# EAGLE schematic ams-master-pcb (EAGLE 9.6.2)
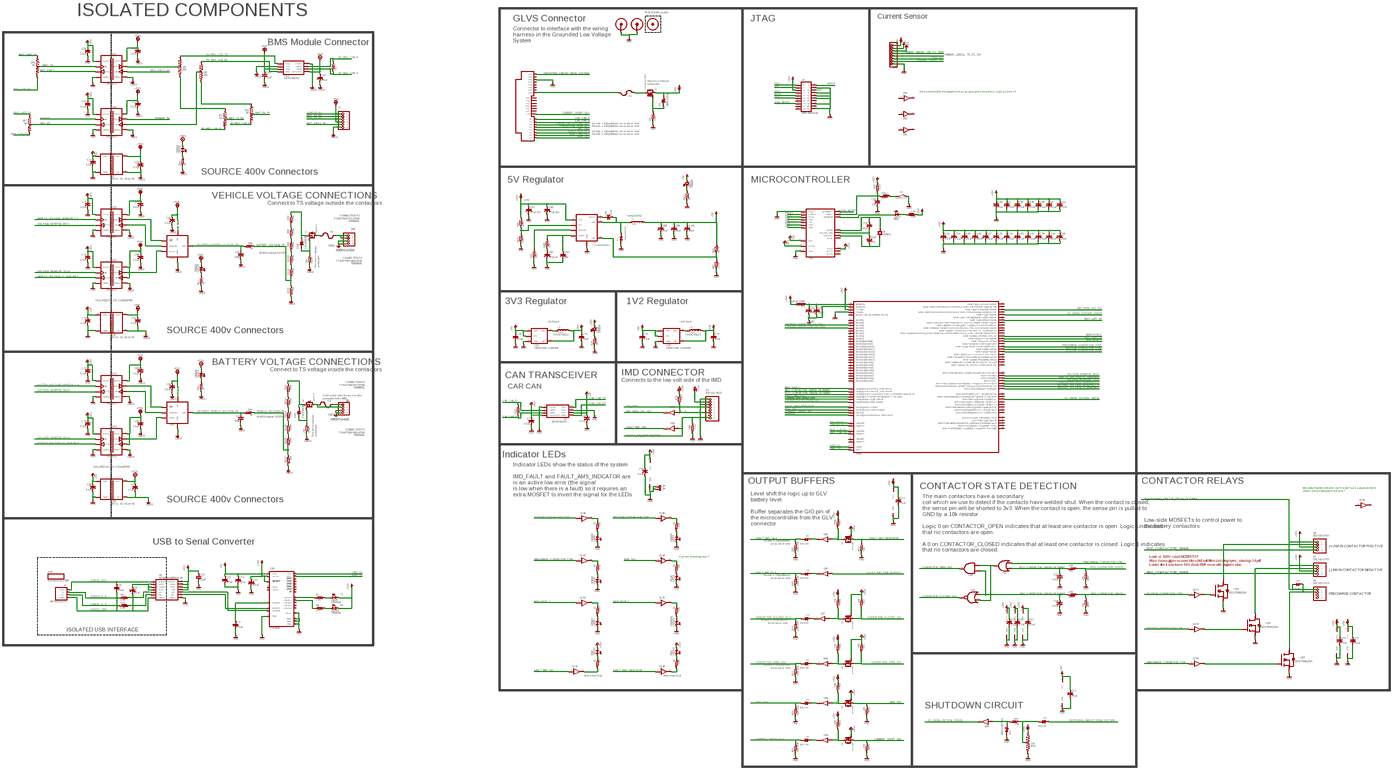
[diagram p0: schematic, sheet 1, overview]
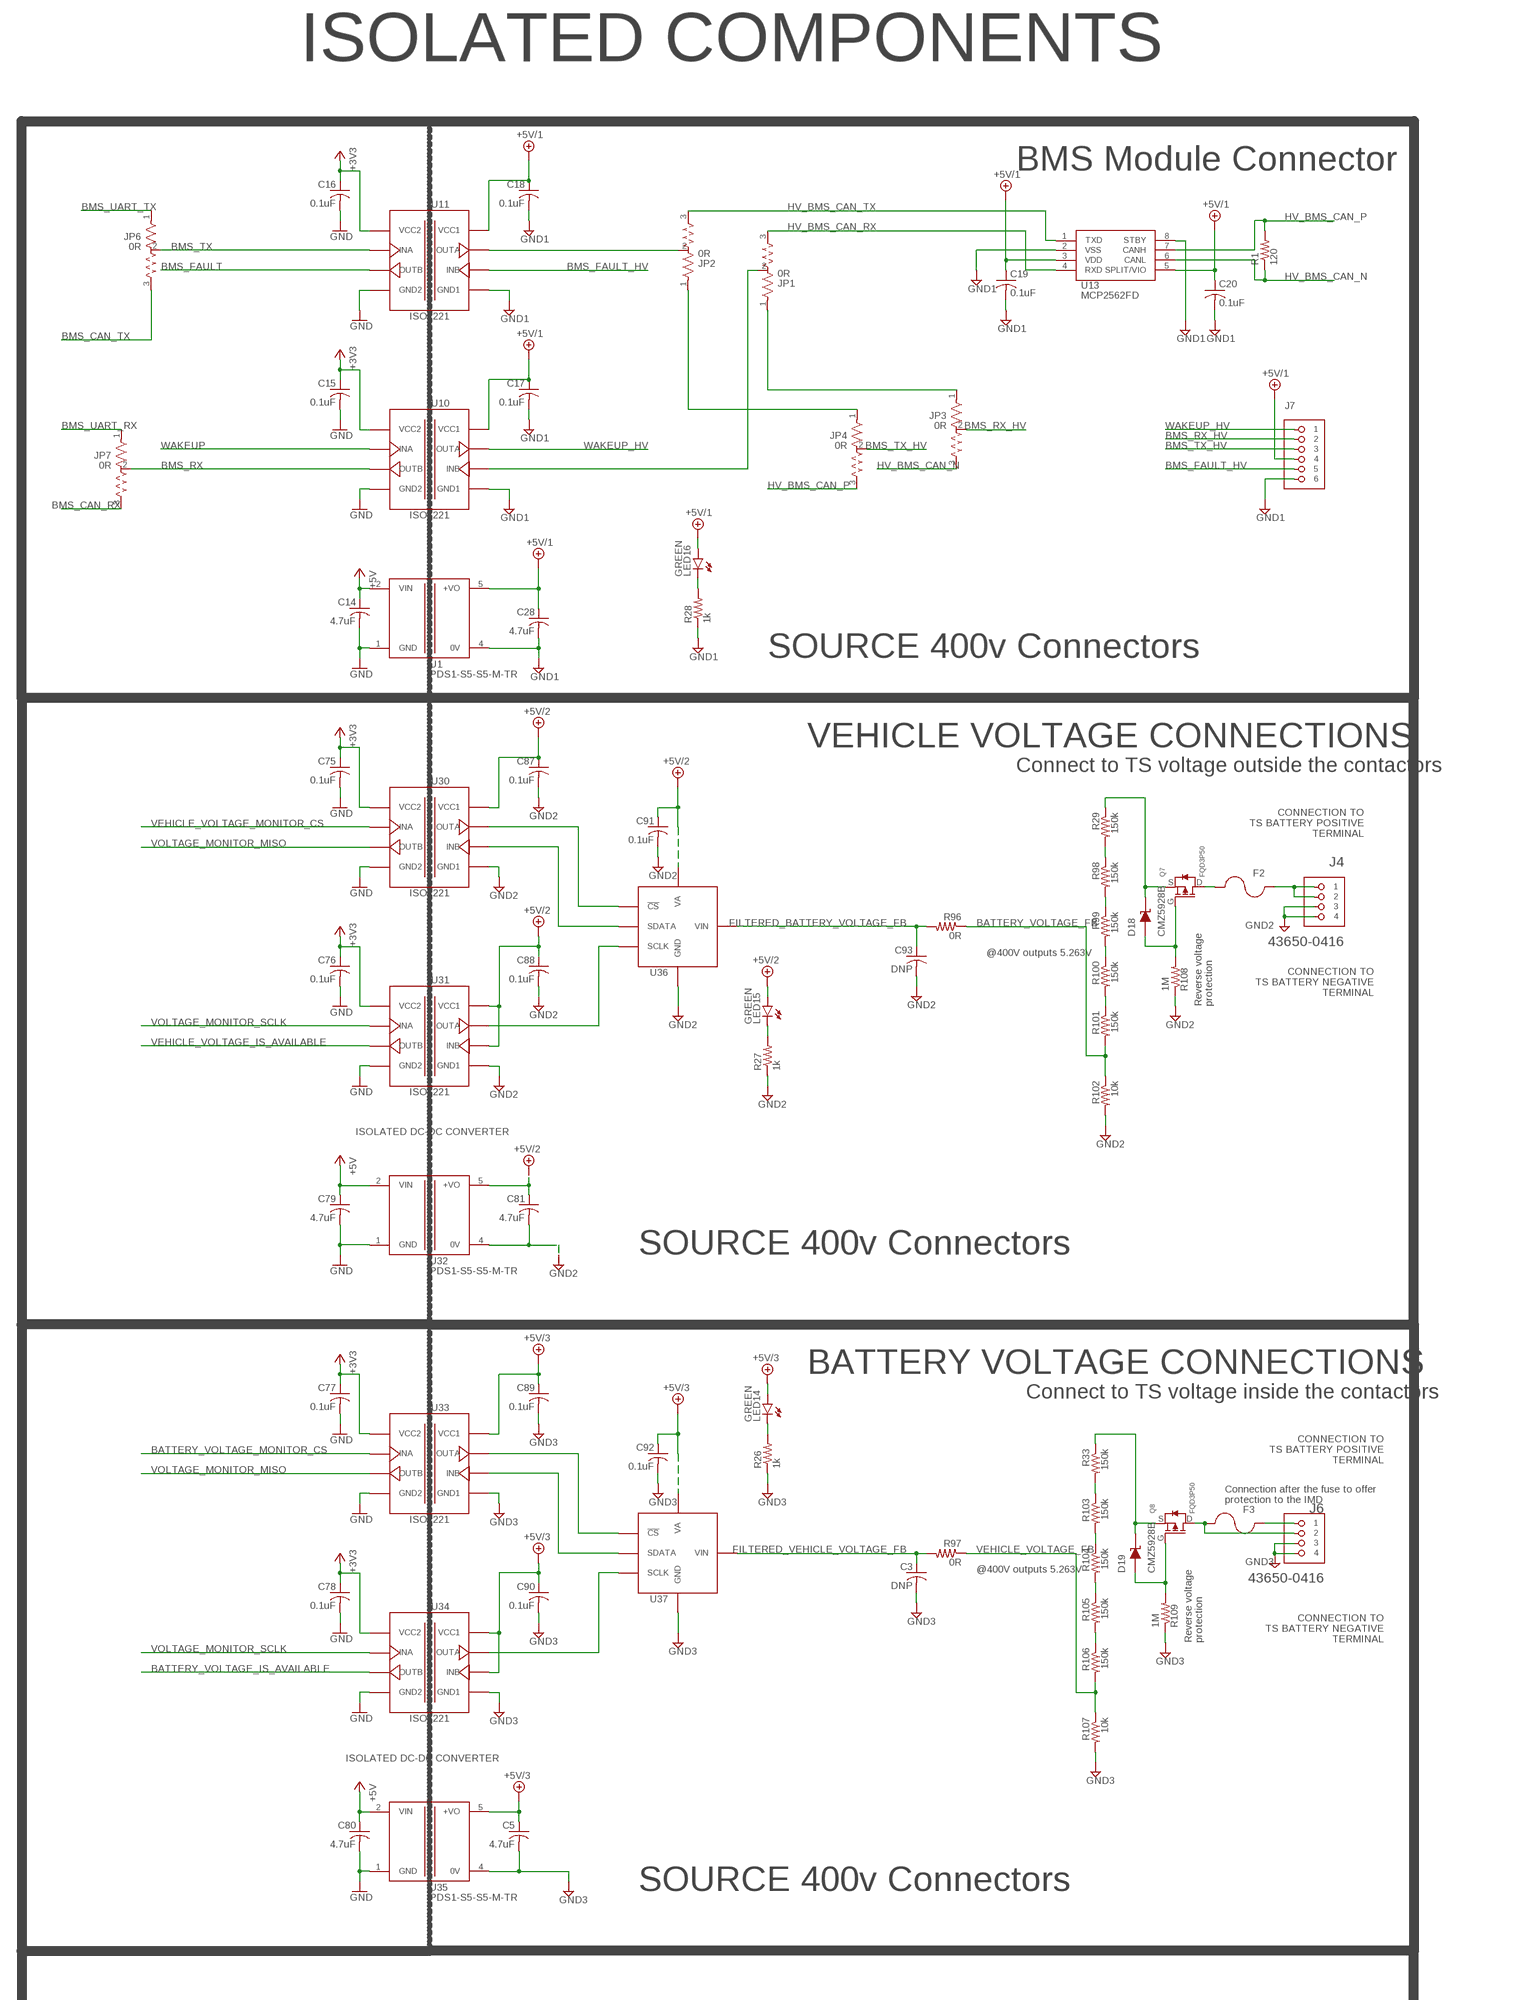
[diagram p1: schematic, sheet 1, part 1 of 6]
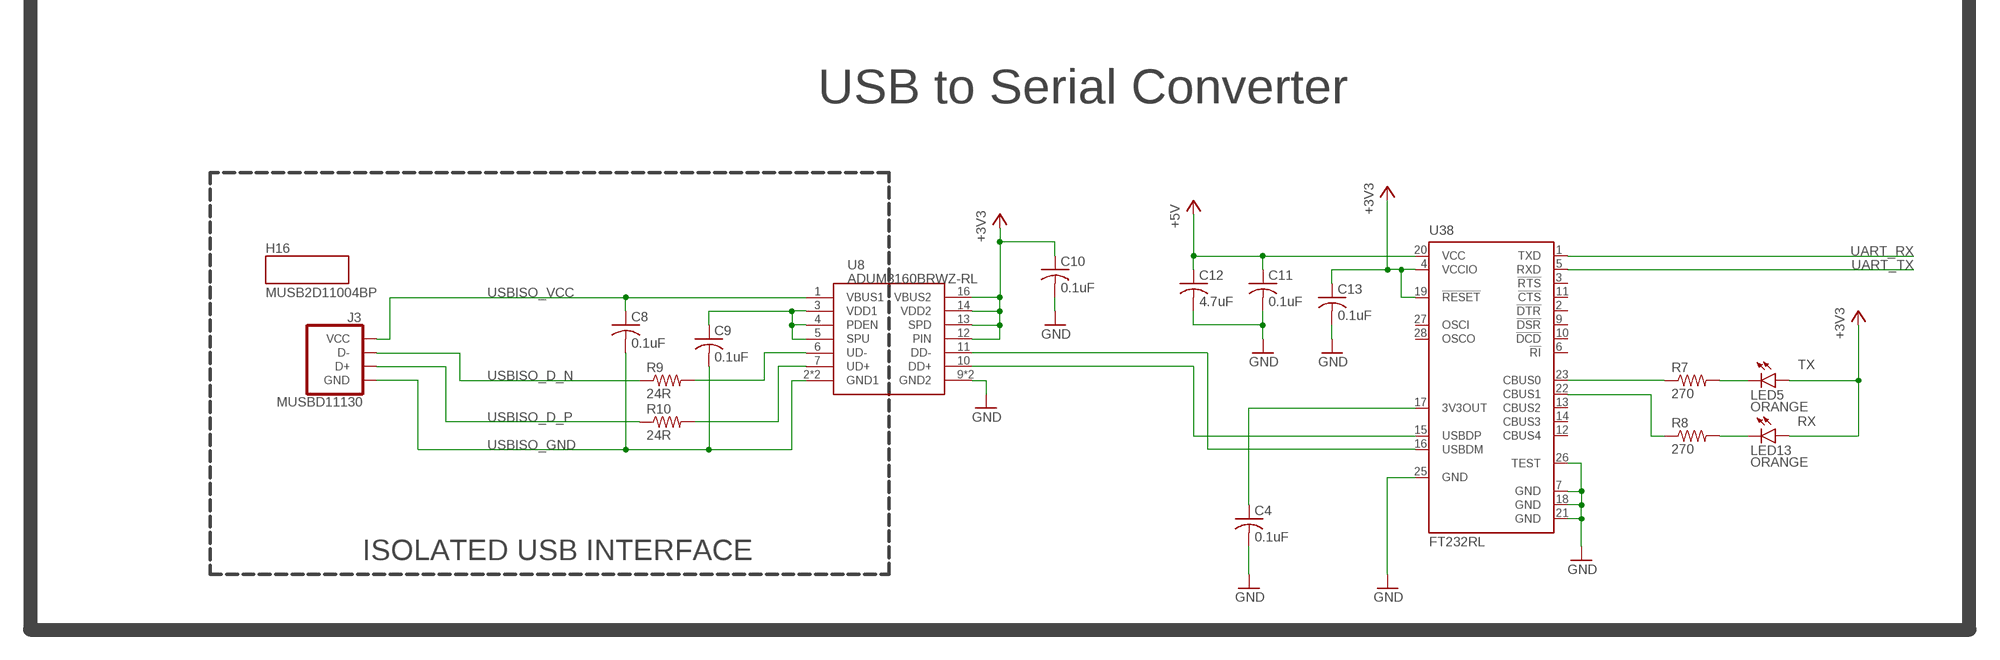
[diagram p2: schematic, sheet 1, part 2 of 6]
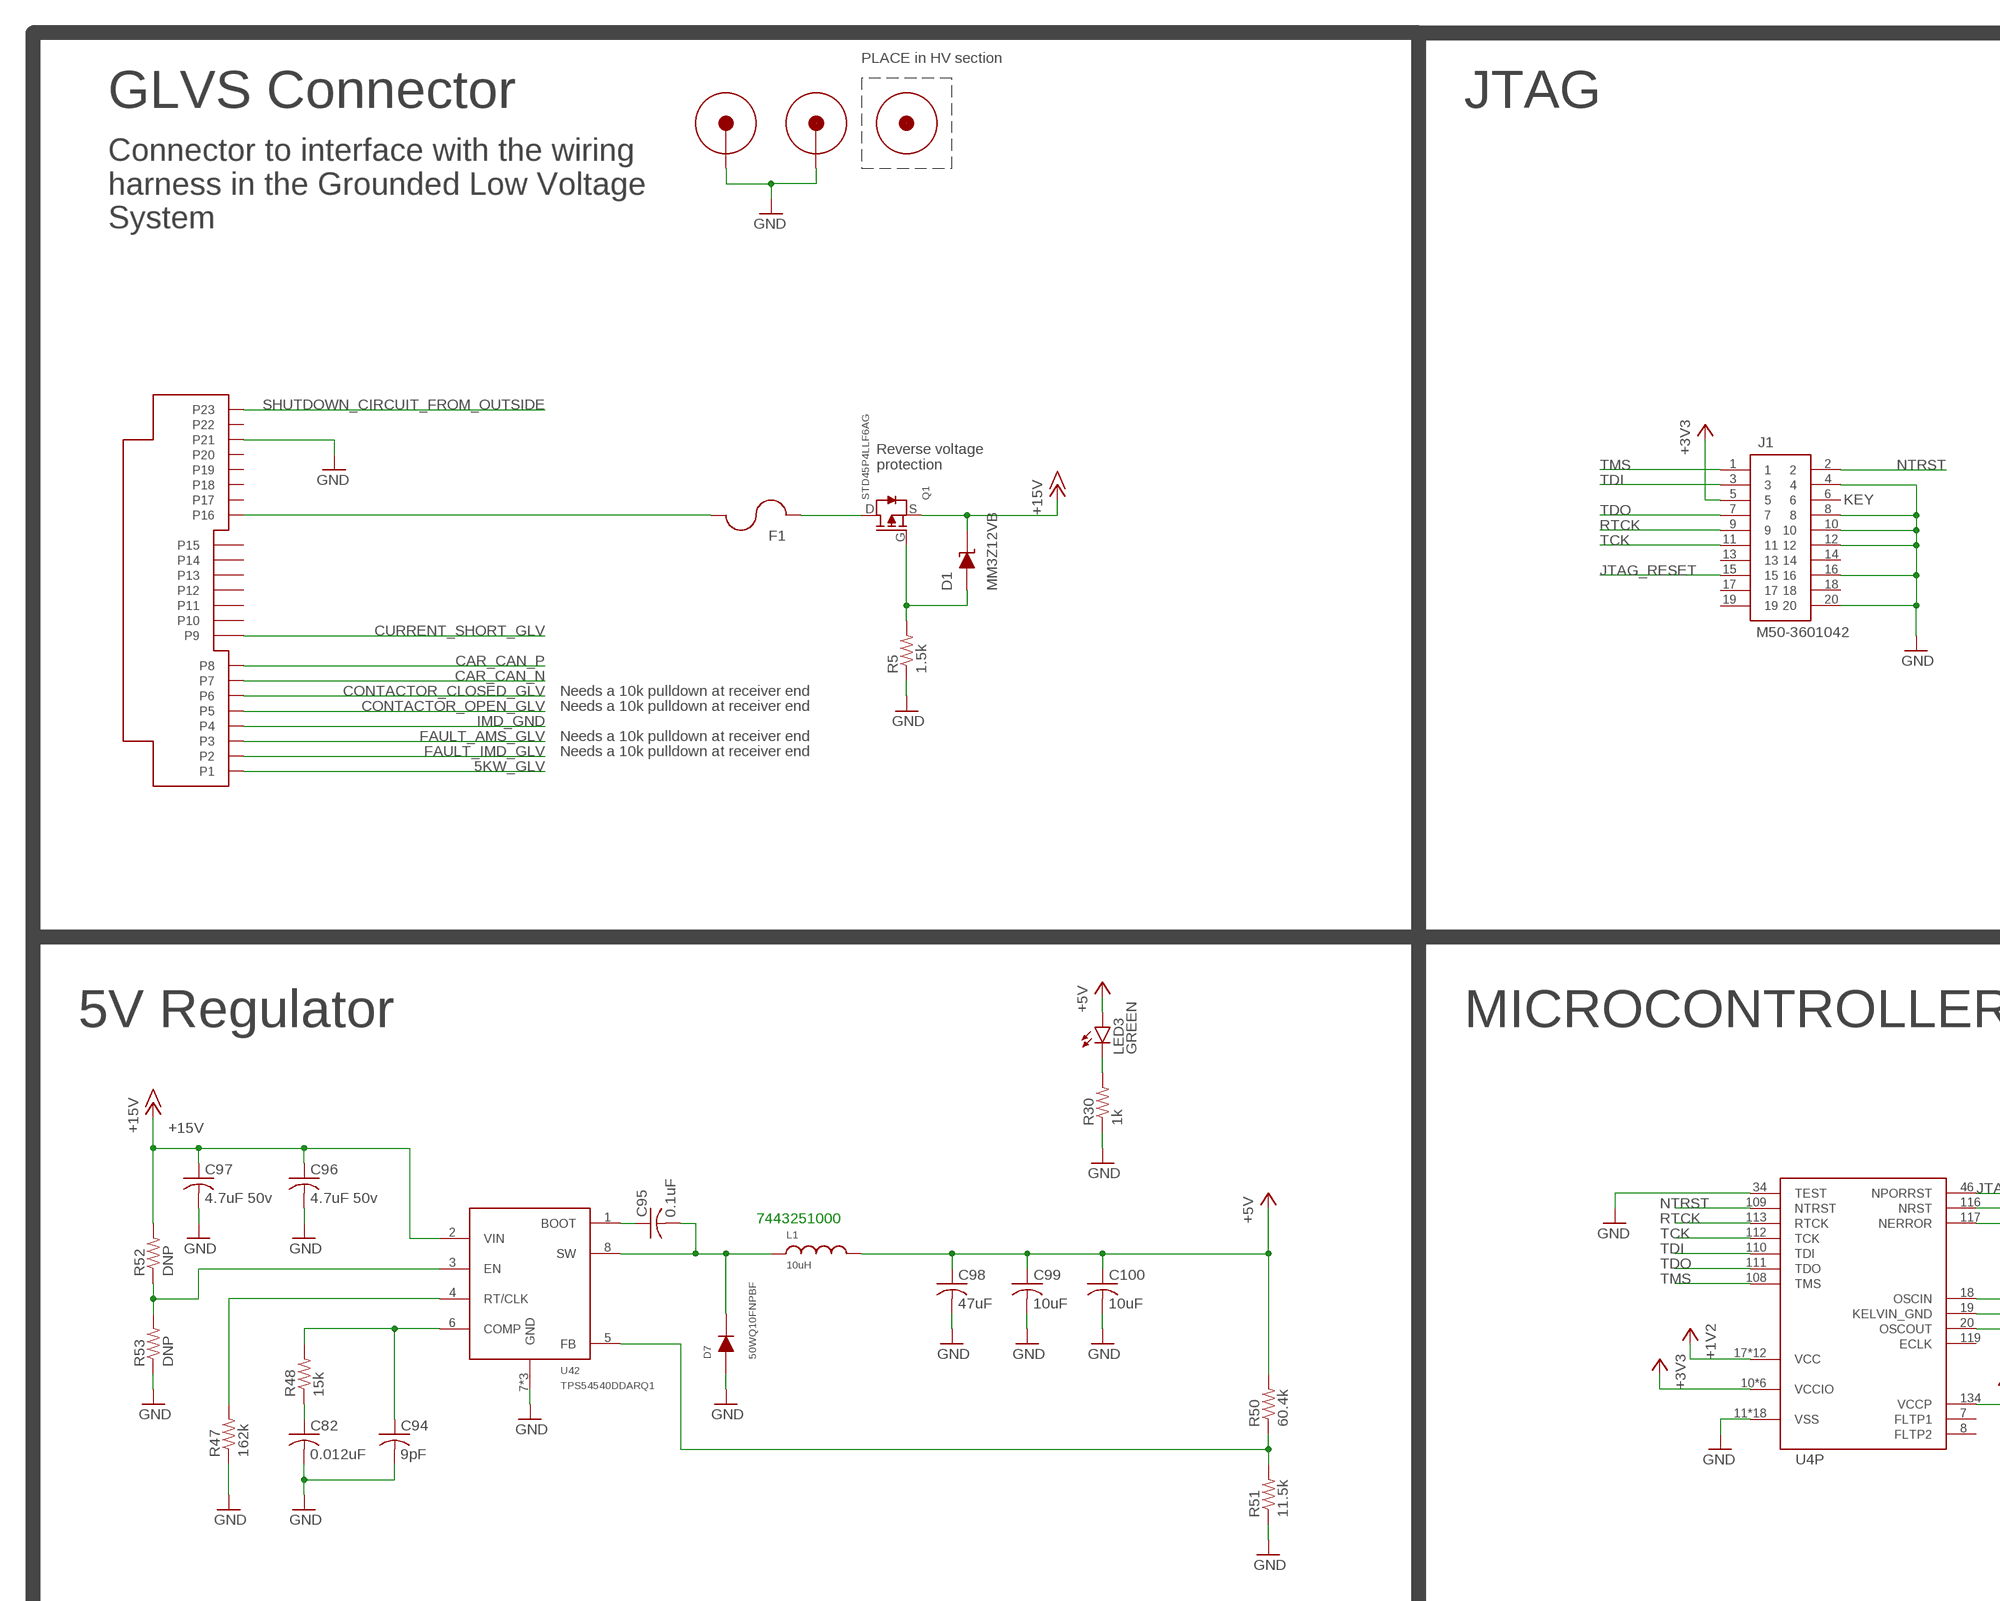
[diagram p3: schematic, sheet 1, part 3 of 6]
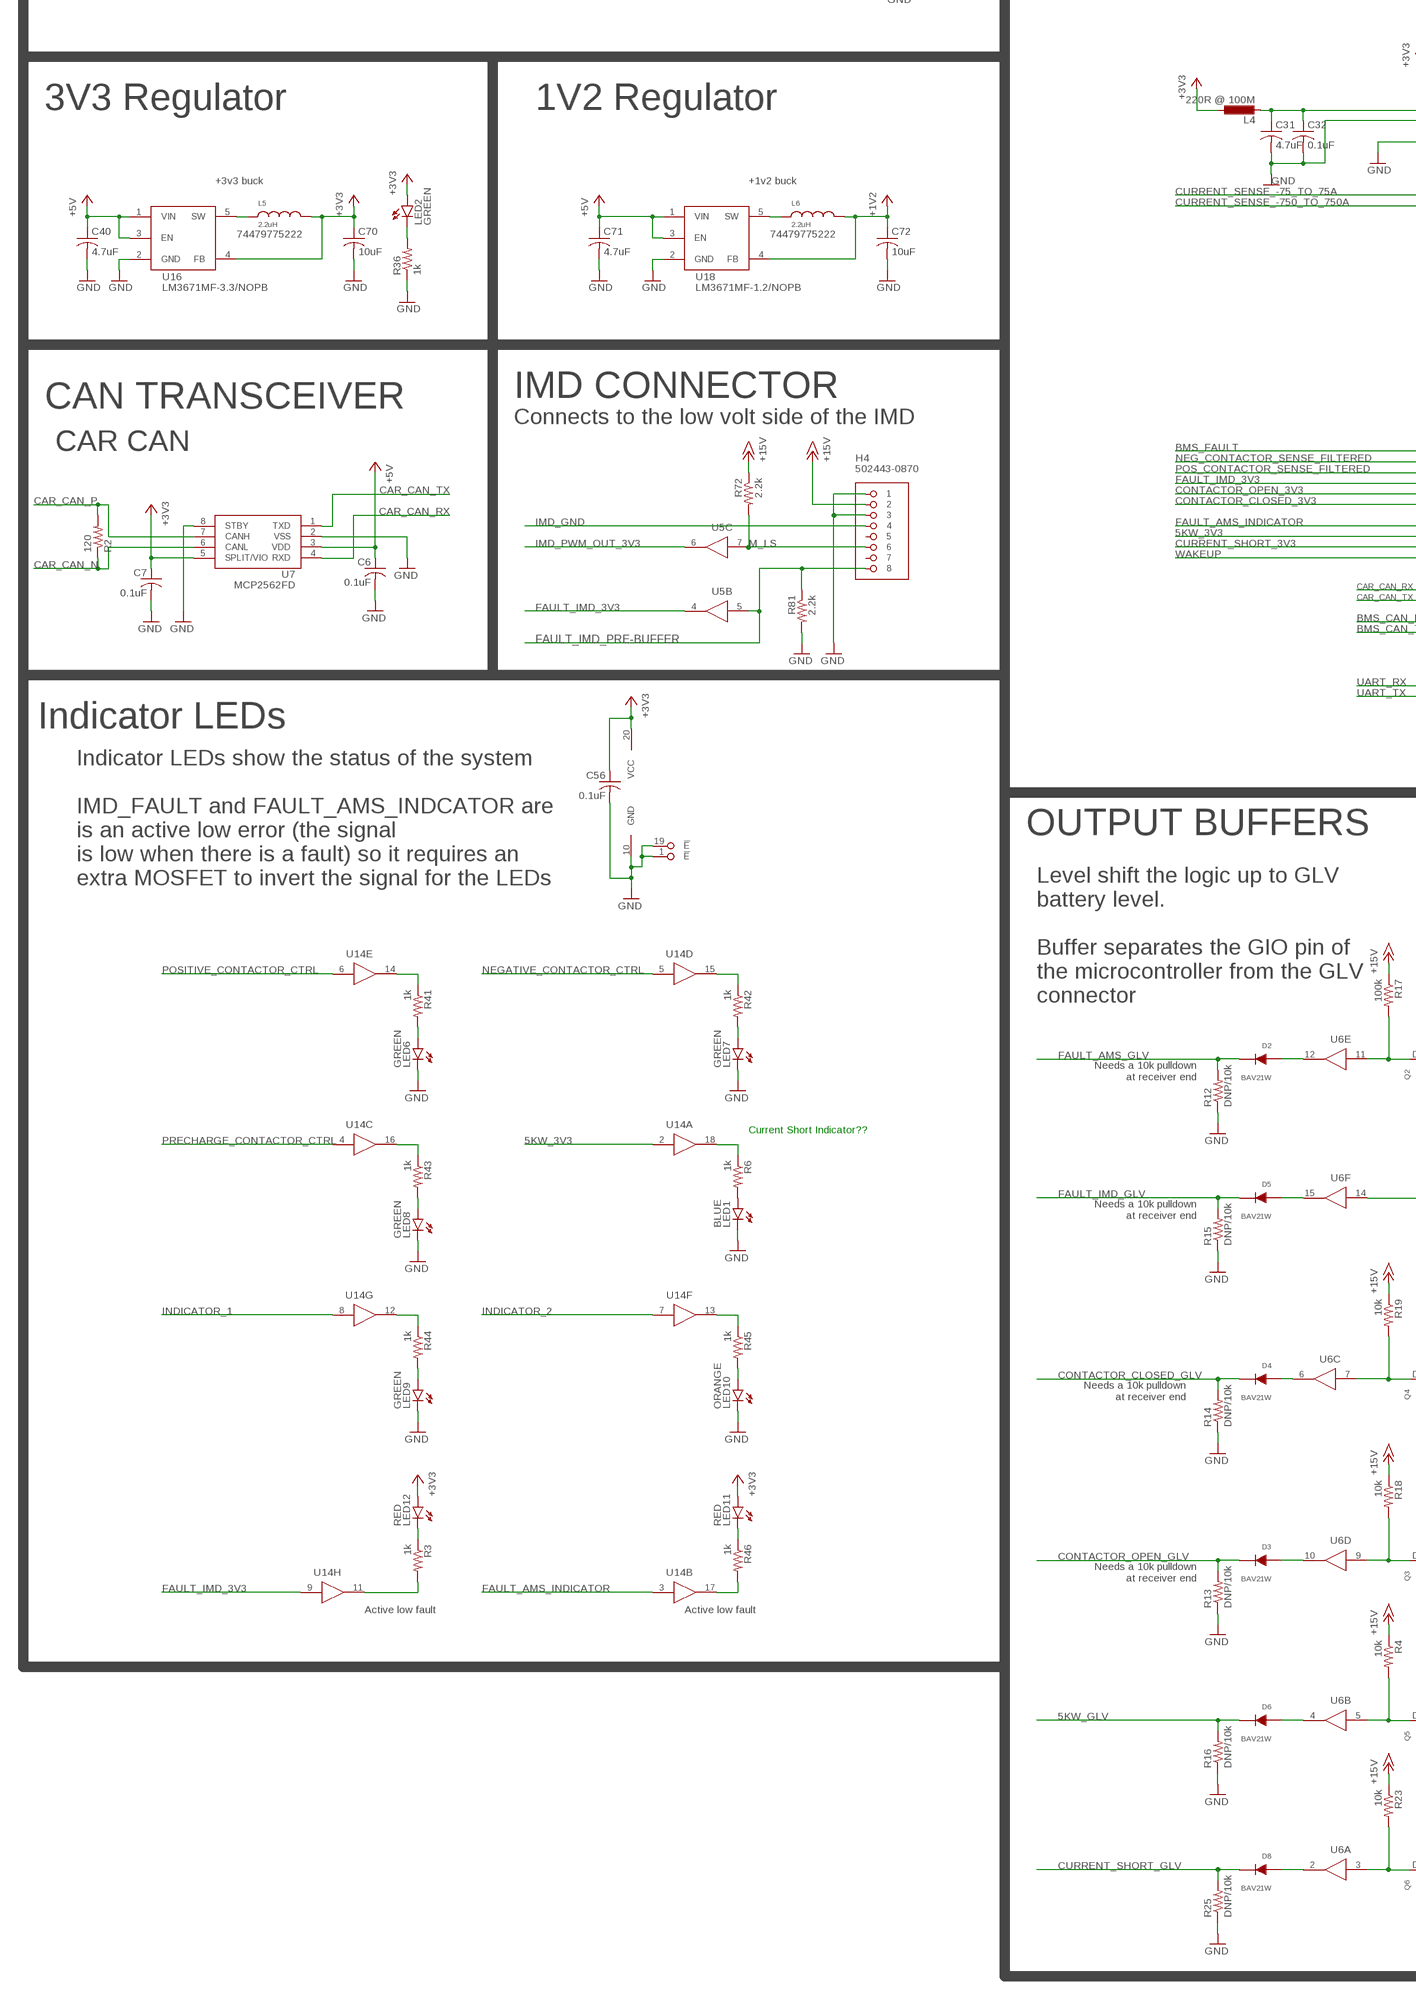
[diagram p4: schematic, sheet 1, part 4 of 6]
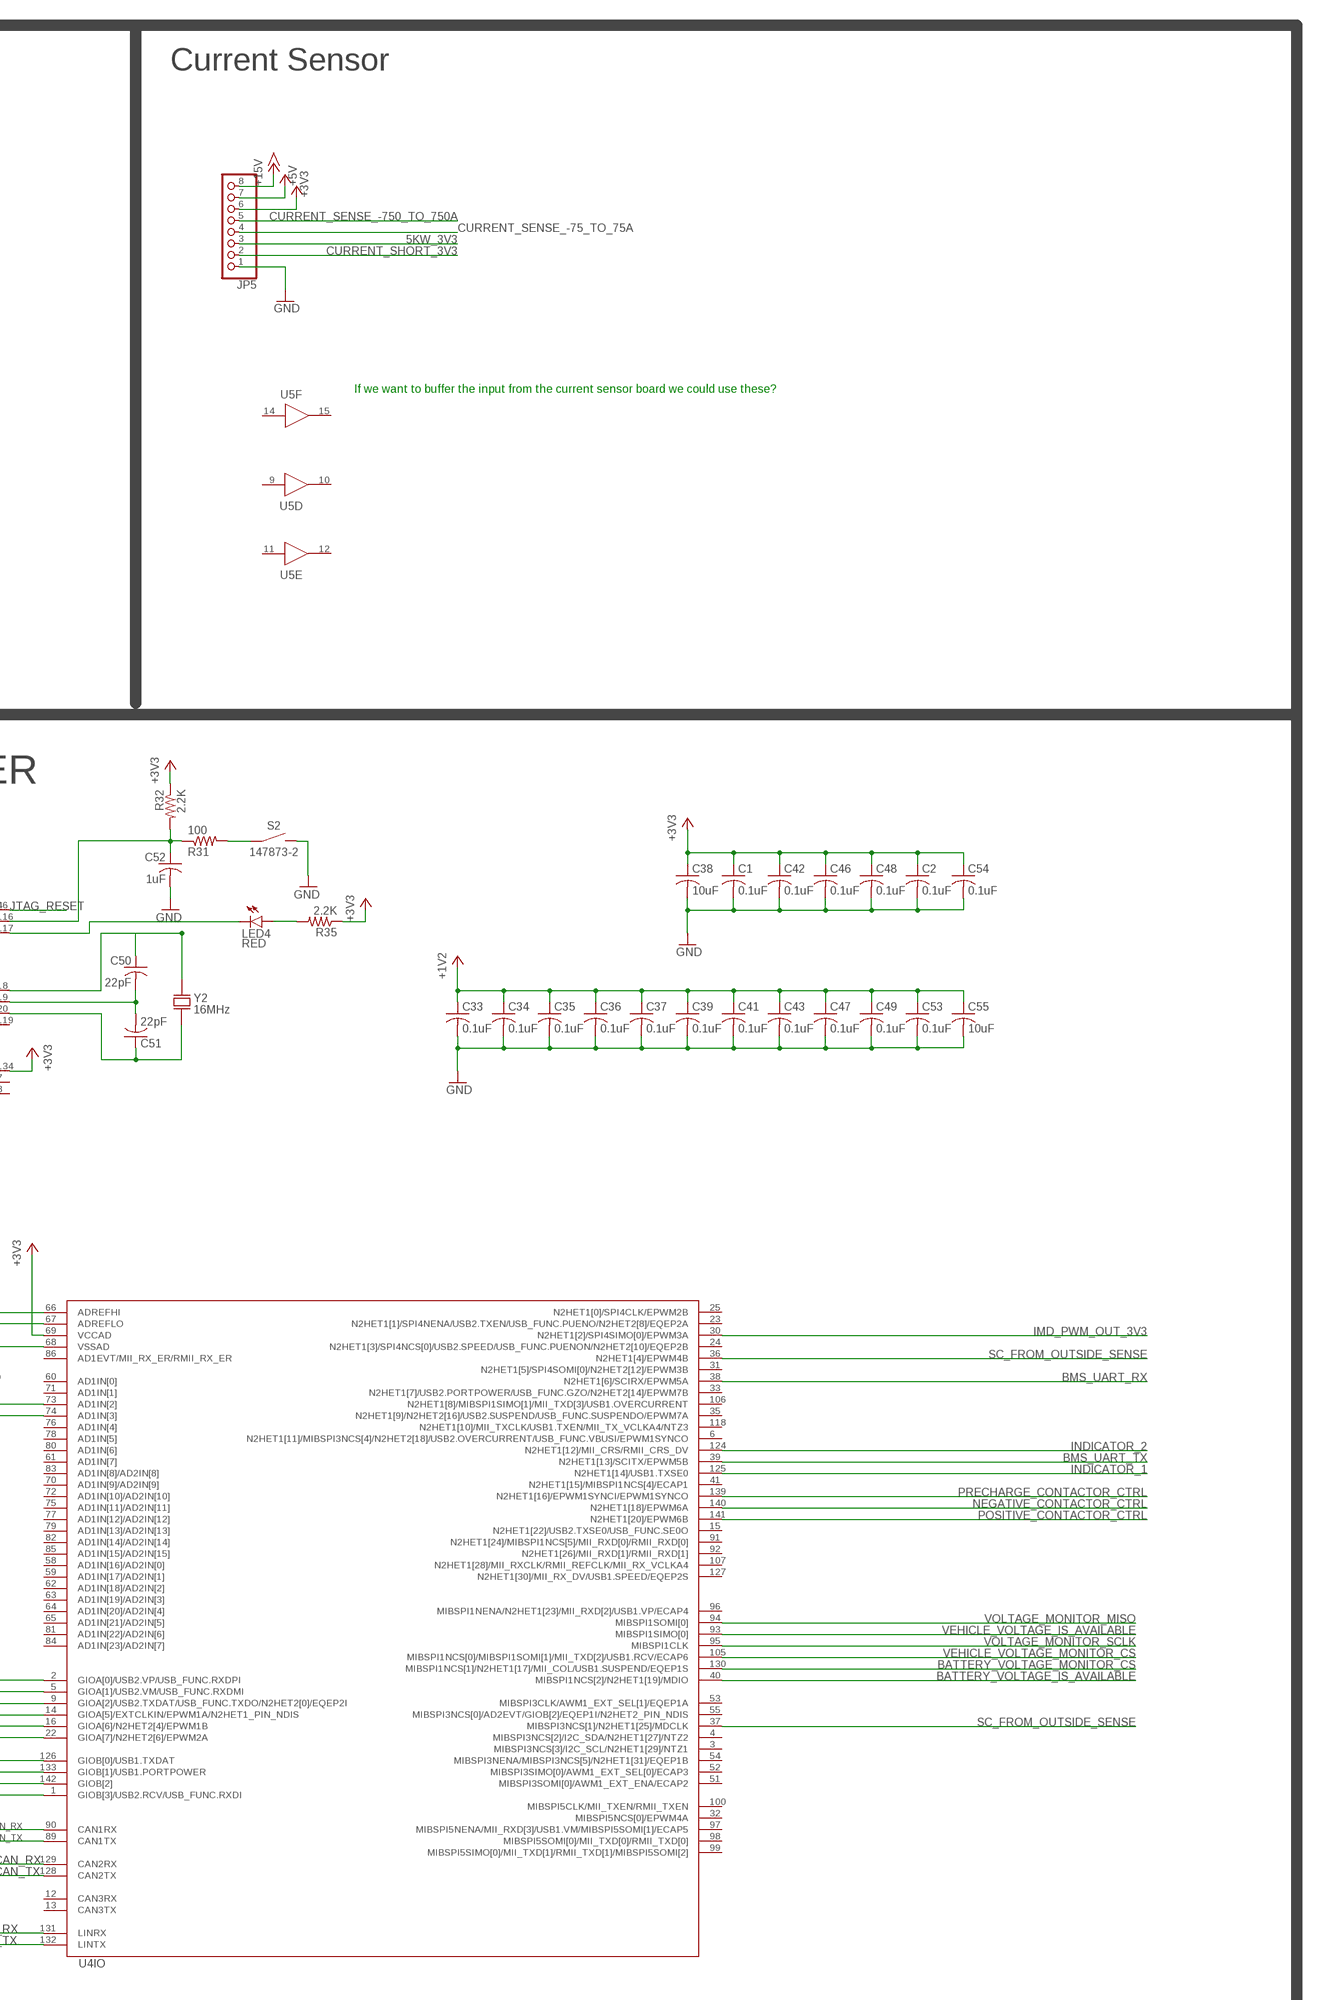
[diagram p5: schematic, sheet 1, part 5 of 6]
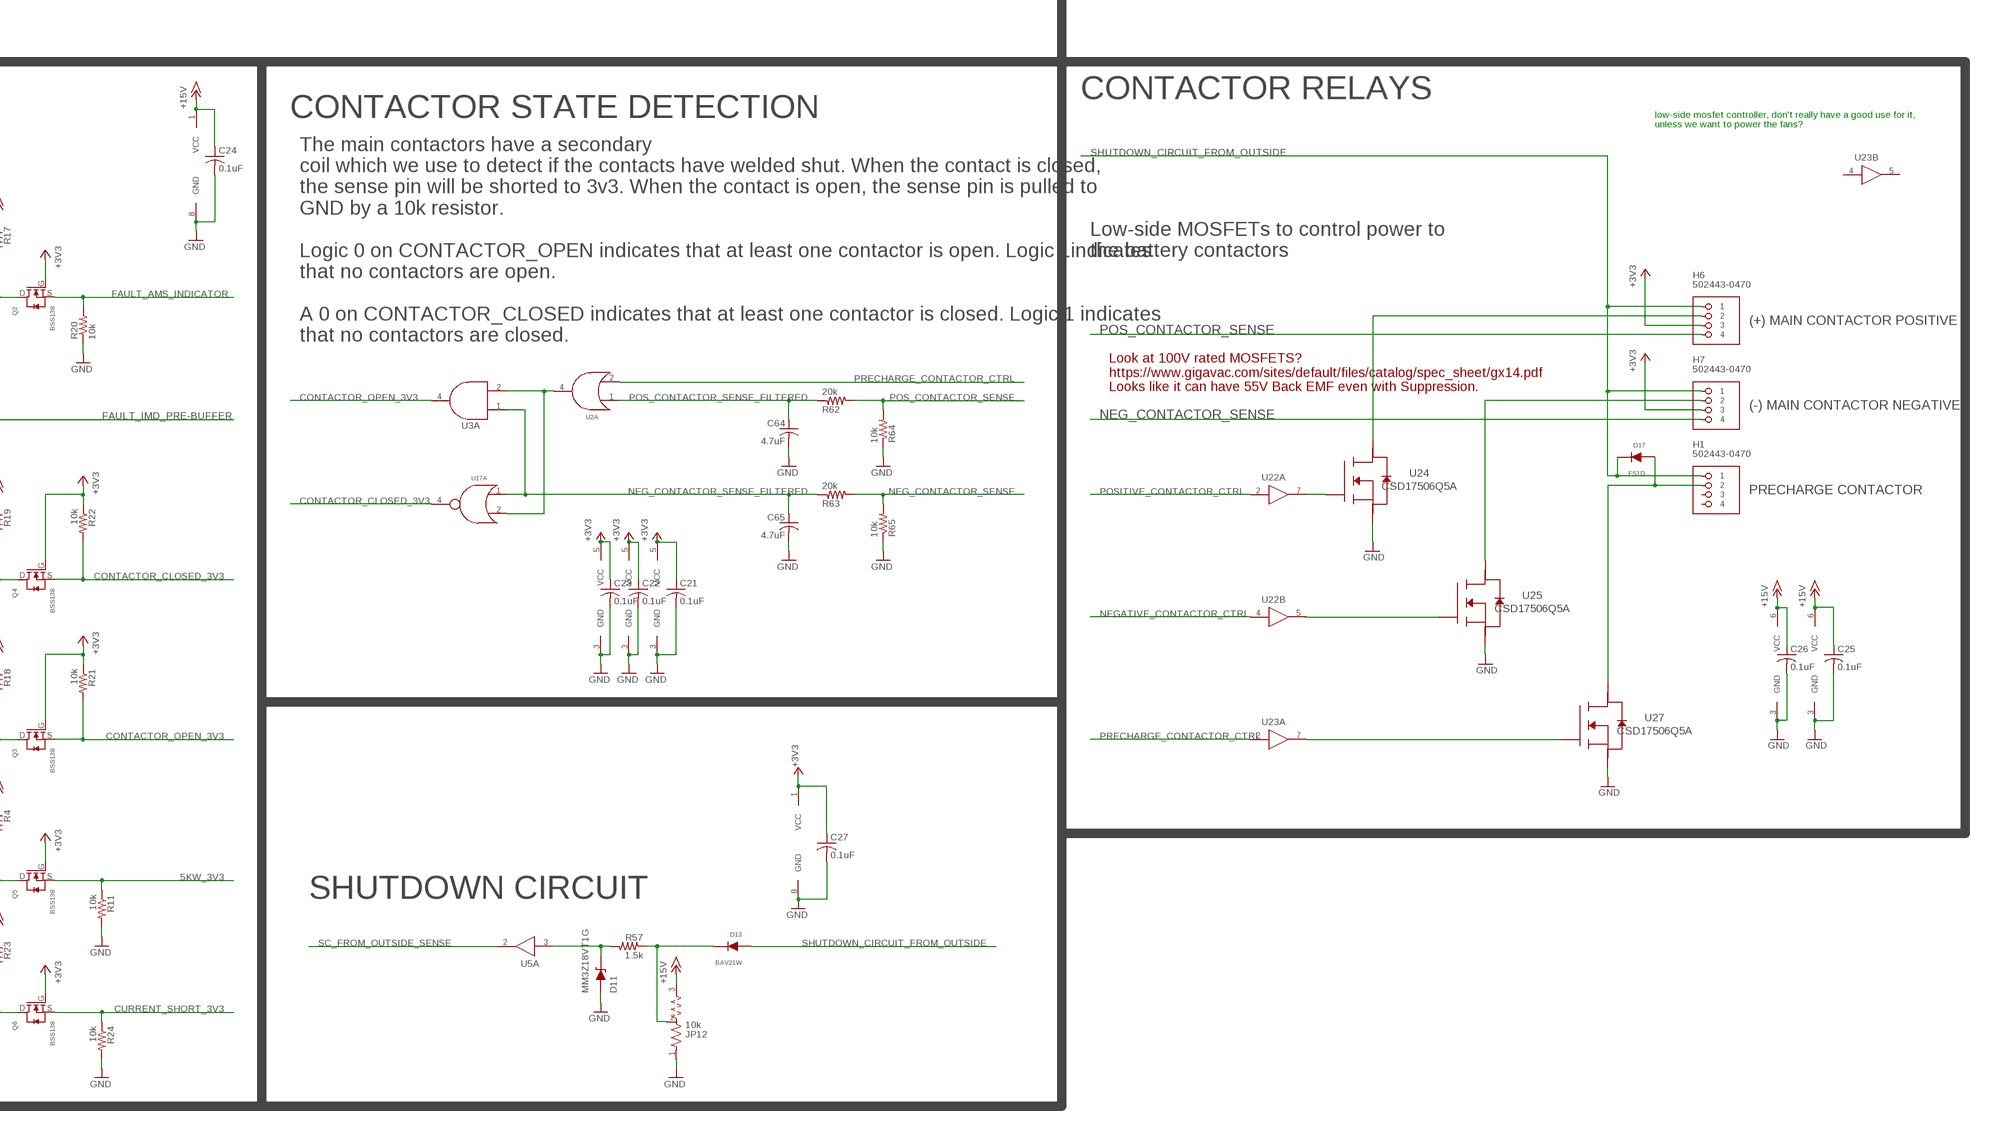
[diagram p6: schematic, sheet 1, part 6 of 6]

## Parts
C1  0.1uF  C-USC0603K  [C0603K]
C2  0.1uF  C-USC0603K  [C0603K]
C3  DNP  C-USC0603K  [C0603K]
C4  0.1uF  C-USC0603K  [C0603K]
C5  4.7uF  C-USC0603K  [C0603K]
C6  0.1uF  C-USC0603K  [C0603K]
C7  0.1uF  C-USC0603K  [C0603K]
C8  0.1uF  C-USC0603K  [C0603K]
C9  0.1uF  C-USC0603K  [C0603K]
C10  0.1uF  C-USC0603K  [C0603K]
C11  0.1uF  C-USC0603K  [C0603K]
C12  4.7uF  C-USC0603K  [C0603K]
C13  0.1uF  C-USC0603K  [C0603K]
C14  4.7uF  C-USC0603K  [C0603K]
C15  0.1uF  C-USC0603K  [C0603K]
C16  0.1uF  C-USC0603K  [C0603K]
C17  0.1uF  C-USC0603K  [C0603K]
C18  0.1uF  C-USC0603K  [C0603K]
C19  0.1uF  C-USC0603K  [C0603K]
C20  0.1uF  C-USC0603K  [C0603K]
C21  0.1uF  C-USC0603K  [C0603K]
C22  0.1uF  C-USC0603K  [C0603K]
C23  0.1uF  C-USC0603K  [C0603K]
C24  0.1uF  C-USC0603K  [C0603K]
C25  0.1uF  C-USC0603K  [C0603K]
C26  0.1uF  C-USC0603K  [C0603K]
C27  0.1uF  C-USC0603K  [C0603K]
C28  4.7uF  C-USC0603K  [C0603K]
C31  4.7uF  C-USC0603K  [C0603K]
C32  0.1uF  C-USC0603K  [C0603K]
C33  0.1uF  C-USC0603K  [C0603K]
C34  0.1uF  C-USC0603K  [C0603K]
C35  0.1uF  C-USC0603K  [C0603K]
C36  0.1uF  C-USC0603K  [C0603K]
C37  0.1uF  C-USC0603K  [C0603K]
C38  10uF  C-USC0603K  [C0603K]
C39  0.1uF  C-USC0603K  [C0603K]
C40  4.7uF  C-USC0603K  [C0603K]
C41  0.1uF  C-USC0603K  [C0603K]
C42  0.1uF  C-USC0603K  [C0603K]
C43  0.1uF  C-USC0603K  [C0603K]
C46  0.1uF  C-USC0603K  [C0603K]
C47  0.1uF  C-USC0603K  [C0603K]
C48  0.1uF  C-USC0603K  [C0603K]
C49  0.1uF  C-USC0603K  [C0603K]
C50  22pF  C-USC0603K  [C0603K]
C51  22pF  C-USC0603K  [C0603K]
C52  1uF  C-USC0603K  [C0603K]
C53  0.1uF  C-USC0603K  [C0603K]
C54  0.1uF  C-USC0603K  [C0603K]
C55  10uF  C-USC0603K  [C0603K]
C56  0.1uF  C-USC0603K  [C0603K]
C64  4.7uF  C-USC0603K  [C0603K]
C65  4.7uF  C-USC0603K  [C0603K]
C70  10uF  C-USC0603K  [C0603K]
C71  4.7uF  C-USC0603K  [C0603K]
C72  10uF  C-USC0603K  [C0603K]
C75  0.1uF  C-USC0603K  [C0603K]
C76  0.1uF  C-USC0603K  [C0603K]
C77  0.1uF  C-USC0603K  [C0603K]
C78  0.1uF  C-USC0603K  [C0603K]
C79  4.7uF  C-USC0603K  [C0603K]
C80  4.7uF  C-USC0603K  [C0603K]
C81  4.7uF  C-USC0603K  [C0603K]
C82  0.012uF  C-USC0603K  [C0603K]
C87  0.1uF  C-USC0603K  [C0603K]
C88  0.1uF  C-USC0603K  [C0603K]
C89  0.1uF  C-USC0603K  [C0603K]
C90  0.1uF  C-USC0603K  [C0603K]
C91  0.1uF  C-USC0603K  [C0603K]
C92  0.1uF  C-USC0603K  [C0603K]
C93  DNP  C-USC0603K  [C0603K]
C94  9pF  C-USC0603K  [C0603K]
C95  0.1uF  C-USC0603K  [C0603K]
C96  4.7uF 50v  C-USC1206  [C1206]
C97  4.7uF 50v  C-USC1206  [C1206]
C98  47uF  C-USC1206  [C1206]
C99  10uF  C-USC0603K  [C0603K]
C100  10uF  C-USC0603K  [C0603K]
D1  MM3Z12VB  [SOD323F]
D2  BAV21W  [BAV21W]
D3  BAV21W  [BAV21W]
D4  BAV21W  [BAV21W]
D5  BAV21W  [BAV21W]
D6  BAV21W  [BAV21W]
D7  50WQ10FNPBF  VISHAY-50WQ10FNPBF  [DPAK]
D8  BAV21W  [BAV21W]
D11  MM3Z18VT1G  [SOD-323]
D13  BAV21W  [BAV21W]
D17  ES1D  [ES1D]
D18  CMZ5928B  CMZ5931B  [CMZ59]
D19  CMZ5928B  CMZ5931B  [CMZ59]
F1  0458005.DR  FUSE_GENERIC_1206  [FUSE_GENERIC_1206]
F2  0485001.DR  LITTELFUSE_485  [LITTELFUSE_485]
F3  0485001.DR  LITTELFUSE_485  [LITTELFUSE_485]
H1  502443-0470  MOLEX_502443-0470  [MOLEX_5024430470]
H2  MOUNT-HOLE-NPTH3.8MM  [MOUNT-HOLE-3.8MM-NPTH]
H4  502443-0870  MOLEX_502443-0870  [MOLEX_5024430870]
H6  502443-0470  MOLEX_502443-0470  [MOLEX_5024430470]
H7  502443-0470  MOLEX_502443-0470  [MOLEX_5024430470]
H16  MUSB2D11004BP  GENERIC_BLOCK  [EMPTY_FOOTPRINT]
J1  M50-3601042  CTI-20-MALE  [SAMTEC-FTR-DUALROW]
J2  TE-776087  [TE-776087]
J3  MUSBD11130  MUSBD111XX  [MUSBD111XX]
J4  MOLEX_43650-0416MOLEX_43650-0416_0_0  [MOLEX_43650-0416_0]
J6  MOLEX_43650-0416MOLEX_43650-0416_0_0  [MOLEX_43650-0416_0]
J7  43650-0616  MOLEX_43650-0616  [MOLEX_43650-0616]
JP1  0R  TWO-WAY-JUMPER-0603  [0603-TWO-WAY-JUMPER]
JP2  0R  TWO-WAY-JUMPER-0603  [0603-TWO-WAY-JUMPER]
JP3  0R  TWO-WAY-JUMPER-0603  [0603-TWO-WAY-JUMPER]
JP4  0R  TWO-WAY-JUMPER-0603  [0603-TWO-WAY-JUMPER]
JP5  PINHD-1X8/90  [1X08/90]
JP6  0R  TWO-WAY-JUMPER-0603  [0603-TWO-WAY-JUMPER]
JP7  0R  TWO-WAY-JUMPER-0603  [0603-TWO-WAY-JUMPER]
JP12  10k  TWO-WAY-JUMPER-0603  [0603-TWO-WAY-JUMPER]
L1  10uH  WURTH-744325XXXX  [WURTH-744325XXXX]
L4  220R @ 100M  INDUCTOR  [0805]
L5  2.2uH  L0805  [0805]
L6  2.2uH  L0805  [0805]
LED1  BLUE  LEDCHIP-LED0805  [CHIP-LED0805]
LED2  GREEN  LEDCHIP-LED0805  [CHIP-LED0805]
LED3  GREEN  LEDCHIP-LED0805  [CHIP-LED0805]
LED4  RED  LEDCHIP-LED0805  [CHIP-LED0805]
LED5  ORANGE  LEDCHIP-LED0805  [CHIP-LED0805]
LED6  GREEN  LEDCHIP-LED0805  [CHIP-LED0805]
LED7  GREEN  LEDCHIP-LED0805  [CHIP-LED0805]
LED8  GREEN  LEDCHIP-LED0805  [CHIP-LED0805]
LED9  GREEN  LEDCHIP-LED0805  [CHIP-LED0805]
LED10  ORANGE  LEDCHIP-LED0805  [CHIP-LED0805]
LED11  RED  LEDCHIP-LED0805  [CHIP-LED0805]
LED12  RED  LEDCHIP-LED0805  [CHIP-LED0805]
LED13  ORANGE  LEDCHIP-LED0805  [CHIP-LED0805]
LED14  GREEN  LEDCHIP-LED0805  [CHIP-LED0805]
LED15  GREEN  LEDCHIP-LED0805  [CHIP-LED0805]
LED16  GREEN  LEDCHIP-LED0805  [CHIP-LED0805]
MP1  MOUNT-HOLE3.8MM  [MOUNT-HOLE-3.8MM]
MP2  MOUNT-HOLE3.8MM  [MOUNT-HOLE-3.8MM]
Q1  STD45P4LLF6AG  [STD45P4LLF6AG]
Q2  BSS138  [BSS138]
Q3  BSS138  [BSS138]
Q4  BSS138  [BSS138]
Q5  BSS138  [BSS138]
Q6  BSS138  [BSS138]
Q7  FQD3P50  [FQD3P50]
Q8  FQD3P50  [FQD3P50]
R1  120  R-US_R0603  [R0603]
R2  120  R-US_R0603  [R0603]
R3  1k  R-US_R0603  [R0603]
R4  10k  R-US_R0603  [R0603]
R5  1.5k  R-US_R0603  [R0603]
R6  1k  R-US_R0603  [R0603]
R7  270  R-US_R0603  [R0603]
R8  270  R-US_R0603  [R0603]
R9  24R  R-US_R0603  [R0603]
R10  24R  R-US_R0603  [R0603]
R11  10k  R-US_R0603  [R0603]
R12  DNP/10k  R-US_R0603  [R0603]
R13  DNP/10k  R-US_R0603  [R0603]
R14  DNP/10k  R-US_R0603  [R0603]
R15  DNP/10k  R-US_R0603  [R0603]
R16  DNP/10k  R-US_R0603  [R0603]
R17  100k  R-US_R0603  [R0603]
R18  10k  R-US_R0603  [R0603]
R19  10k  R-US_R0603  [R0603]
R20  10k  R-US_R0603  [R0603]
R21  10k  R-US_R0603  [R0603]
R22  10k  R-US_R0603  [R0603]
R23  10k  R-US_R0603  [R0603]
R24  10k  R-US_R0603  [R0603]
R25  DNP/10k  R-US_R0603  [R0603]
R26  1k  R-US_R0603  [R0603]
R27  1k  R-US_R0603  [R0603]
R28  1k  R-US_R0603  [R0603]
R29  150k  R-US_R0805  [R0805]
R30  1k  R-US_R0603  [R0603]
R31  100  R-US_R0603  [R0603]
R32  2.2K  R-US_R0603  [R0603]
R33  150k  R-US_R0805  [R0805]
R35  2.2K  R-US_R0603  [R0603]
R36  1k  R-US_R0603  [R0603]
R41  1k  R-US_R0603  [R0603]
R42  1k  R-US_R0603  [R0603]
R43  1k  R-US_R0603  [R0603]
R44  1k  R-US_R0603  [R0603]
R45  1k  R-US_R0603  [R0603]
R46  1k  R-US_R0603  [R0603]
R47  162k  R-US_R0603  [R0603]
R48  15k  R-US_R0603  [R0603]
R50  60.4k  R-US_R0603  [R0603]
R51  11.5k  R-US_R0603  [R0603]
R52  DNP  R-US_R0603  [R0603]
R53  DNP  R-US_R0603  [R0603]
R57  1.5k  R-US_R0603  [R0603]
R62  20k  R-US_R0603  [R0603]
R63  20k  R-US_R0603  [R0603]
R64  10k  R-US_R0603  [R0603]
R65  10k  R-US_R0603  [R0603]
R72  2.2k  R-US_R0603  [R0603]
R81  2.2k  R-US_R0603  [R0603]
R96  0R  R-US_R0603  [R0603]
R97  0R  R-US_R0603  [R0603]
R98  150k  R-US_R0805  [R0805]
R99  150k  R-US_R0805  [R0805]
R100  150k  R-US_R0805  [R0805]
R101  150k  R-US_R0805  [R0805]
R102  10k  R-US_R0603  [R0603]
R103  150k  R-US_R0805  [R0805]
R104  150k  R-US_R0805  [R0805]
R105  150k  R-US_R0805  [R0805]
R106  150k  R-US_R0805  [R0805]
R107  10k  R-US_R0603  [R0603]
R108  1M  R-US_R0805  [R0805]
R109  1M  R-US_R0805  [R0805]
S2  147873-2  TE-147873-2  [TE-147873-2]
U1  PDS1-S5-S5-M-TR  PDS1-M  [PDS1-M]
U2  SN74LVC1G32DBV  LL_OR:SN74LVC1G32-Q1DBV  [SOT23-5]
U3  SN74LVC1G08DBV  LL_AND:SN74LVC1G08DBV  [SOT23-5]
U4  RM46L852  [LQFP144]
U5  CD4050BD  [SOIC-16]
U6  CD4050BD  [SOIC-16]
U7  MCP2562FD  MCP256X-SOIC  [SOIC8-N_MC]
U8  ADUM3160BRWZ-RL  ADUM3160  [ADUM3160]
U10  ISO7221  [ISO722X]
U11  ISO7221  [ISO722X]
U13  MCP2562FD  MCP256X-SOIC  [SOIC8-N_MC]
U14  SN74LVC541A  [TSSOP20_MC]
U16  LM3671MF-3.3/NOPB  LM3671MF  [SOT23-5]
U17  SN74LVC1G02DBV  LL_NOR:SN74LVC1G02DBV  [SOT23-5]
U18  LM3671MF-1.2/NOPB  LM3671MF  [SOT23-5]
U22  FAN3214  [FAN3214]
U23  FAN3214  [FAN3214]
U24  CSD17506Q5A  [SON_5X6]
U25  CSD17506Q5A  [SON_5X6]
U27  CSD17506Q5A  [SON_5X6]
U30  ISO7221  [ISO722X]
U31  ISO7221  [ISO722X]
U32  PDS1-S5-S5-M-TR  PDS1-M  [PDS1-M]
U33  ISO7221  [ISO722X]
U34  ISO7221  [ISO722X]
U35  PDS1-S5-S5-M-TR  PDS1-M  [PDS1-M]
U36  ADC121S021  [ADC121S021]
U37  ADC121S021  [ADC121S021]
U38  FT232RL  [SSOP28]
U42  TPS54540DDARQ1  TPS54540  [TPS54540]
Y2  16MHz  CSM-3X  [CSM-3X]

## Nets
5KW_3V3: JP5.3 Q5.S R11.1 U4.133(IO:GIOB[1]/USB1.PORTPOWER) U14.2(A:IN)
5KW_GLV: D6.CATHODE J2.P$1(P1) R16.2
5VREG_EN1: R52.1 R53.2 U42.3(EN)
+1V2: C33.1 C34.1 C35.1 C36.1 C37.1 C39.1 C41.1 C43.1 C47.1 C49.1 C53.1 C55.1 C72.1 L6.2 U4.17(P:VCC) U4.29(P:VCC) U4.45(P:VCC) U4.48(P:VCC) U4.49(P:VCC) U4.57(P:VCC) U4.87(P:VCC) U4.101(P:VCC) U4.114(P:VCC) U4.123(P:VCC) U4.137(P:VCC) U4.143(P:VCC) U18.4(FB)
+3V3: C1.1 C2.1 C7.1 C10.1 C13.1 C15.1 C16.1 C21.1 C22.1 C23.1 C27.1 C38.1 C42.1 C46.1 C48.1 C54.1 C56.1 C70.1 C75.1 C76.1 C77.1 C78.1 H6.3 H7.3 J1.5 JP5.6 L4.1 L5.2 LED2.A LED5.A LED11.A LED12.A LED13.A Q2.G Q3.G Q4.G Q5.G Q6.G R21.1 R22.1 R32.1 R35.1 U2.5(VCC) U3.5(VCC) U4.10(P:VCCIO) U4.26(P:VCCIO) U4.42(P:VCCIO) U4.69(IO:VCCAD) U4.104(P:VCCIO) U4.120(P:VCCIO) U4.134(P:VCCP) U4.136(P:VCCIO) U5.1(POWER:VCC) U7.5(SPLIT/VIO) U8.12(PIN) U8.13(SPD) U8.14(VDD2) U8.16(VBUS2) U10.P$8(VCC2) U11.P$8(VCC2) U14.20(POWER:VCC) U16.4(FB) U17.5(VCC) U30.P$8(VCC2) U31.P$8(VCC2) U33.P$8(VCC2) U34.P$8(VCC2) U38.4(VCCIO) U38.19(!RESET)
+5V: C6.1 C11.1 C12.1 C14.1 C40.1 C71.1 C79.1 C80.1 C98.1 C99.1 C100.1 JP5.7 L1.P$2 LED3.A R50.2 U1.2(VIN) U7.3(VDD) U16.1(VIN) U16.3(EN) U18.1(VIN) U18.3(EN) U32.2(VIN) U35.2(VIN) U38.20(VCC)
+5V/1: C17.1 C18.1 C19.1 C20.1 C28.1 J7.4 LED16.A U1.5(+VO) U10.P$1(VCC1) U11.P$1(VCC1) U13.3(VDD) U13.5(SPLIT/VIO)
+5V/2: C81.1 C87.1 C88.1 C91.1 LED15.A U30.P$1(VCC1) U31.P$1(VCC1) U31.P$3(INB) U32.5(+VO) U36.P$1(VA)
+5V/3: C5.1 C89.1 C90.1 C92.1 LED14.A U33.P$1(VCC1) U34.P$1(VCC1) U34.P$3(INB) U35.5(+VO) U37.P$1(VA)
+15V: C24.1 C25.1 C26.1 C96.1 C97.1 D1.CATHODE H4.2 JP5.8 JP12.3 Q1.S R4.1 R17.1 R18.1 R19.1 R23.1 R52.2 R72.1 U6.1(POWER:VCC) U22.6(VCC) U23.6(VCC) U42.2(VIN)
BATTERY_VOLTAGE_FB: R96.1 R101.2 R102.1
BATTERY_VOLTAGE_IS_AVAILABLE: U4.40(IO:MIBSPI1NCS[2]/N2HET1[19]/MDIO) U34.P$6(OUTB)
BATTERY_VOLTAGE_MONITOR_CS: U4.130(IO:MIBSPI1NCS[1]/N2HET1[17]/MII_COL/USB1.SUSPEND/EQEP1S) U33.P$7(INA)
BMS_CAN_RX: JP7.3 U4.129(IO:CAN2RX)
BMS_CAN_TX: JP6.3 U4.128(IO:CAN2TX)
BMS_FAULT: U4.2(IO:GIOA[0]/USB2.VP/USB_FUNC.RXDPI) U11.P$6(OUTB)
BMS_FAULT_HV: J7.5 U11.P$3(INB)
BMS_RX: JP7.2 U10.P$6(OUTB)
BMS_RX_HV: J7.2 JP3.2
BMS_TX: JP6.2 U11.P$7(INA)
BMS_TX_HV: J7.3 JP4.2
BMS_UART_RX: JP7.1 U4.38(IO:N2HET1[6]/SCIRX/EPWM5A)
BMS_UART_TX: JP6.1 U4.39(IO:N2HET1[13]/SCITX/EPWM5B)
BOOT_5V2: C95.1 U42.1(BOOT)
CAR_CAN_N [diffPairs]: J2.P$7(P7) R2.1 U7.6(CANL)
CAR_CAN_P [diffPairs]: J2.P$8(P8) R2.2 U7.7(CANH)
CAR_CAN_P1 [diffPairs]: JP2.2 U11.P$2(OUTA)
CAR_CAN_RX: U4.90(IO:CAN1RX) U7.4(RXD)
CAR_CAN_TX: U4.89(IO:CAN1TX) U7.1(TXD)
COMP_5V2: C94.1 R48.2 U42.6(COMP)
CONTACTOR_CLOSED_3V3: Q4.S R22.2 U4.22(IO:GIOA[7]/N2HET2[6]/EPWM2A) U17.4(A:OUT)
CONTACTOR_CLOSED_GLV: D4.CATHODE J2.P$6(P6) R14.2
CONTACTOR_OPEN_3V3: Q3.S R21.2 U3.4(A:OUT) U4.16(IO:GIOA[6]/N2HET2[4]/EPWM1B)
CONTACTOR_OPEN_GLV: D3.CATHODE J2.P$5(P5) R13.2
CURRENT_SENSE_-75_TO_75A: JP5.4 U4.73(IO:AD1IN[2])
CURRENT_SENSE_-750_TO_750A: JP5.5 U4.74(IO:AD1IN[3])
CURRENT_SHORT_3V3: JP5.2 Q6.S R24.1 U4.142(IO:GIOB[2])
CURRENT_SHORT_GLV: D8.CATHODE J2.P$9(P9) R25.2
FAULT_AMS_GLV: D2.CATHODE J2.P$3(P3) R12.2
FAULT_AMS_INDICATOR: Q2.S R20.2 U4.126(IO:GIOB[0]/USB1.TXDAT) U14.3(B:IN)
FAULT_IMD_3V3: U4.14(IO:GIOA[5]/EXTCLKIN/EPWM1A/N2HET1_PIN_NDIS) U5.4(B:OUT) U14.9(H:IN)
FAULT_IMD_GLV: D5.CATHODE J2.P$2(P2) R15.2
FAULT_IMD_PRE-BUFFER: H4.8 R81.1 U5.5(B:IN) U6.14(F:IN)
FB_5V2: R50.1 R51.2 U42.5(FB)
FILTERED_BATTERY_VOLTAGE_FB: C93.1 R96.2 U36.P$3(VIN)
FILTERED_VEHICLE_VOLTAGE_FB: C3.1 R97.2 U37.P$3(VIN)
GND: C1.2 C2.2 C4.2 C6.2 C7.2 C10.2 C11.2 C12.2 C13.2 C14.2 C15.2 C16.2 C21.2 C22.2 C23.2 C24.2 C25.2 C26.2 C27.2 C31.2 C32.2 C33.2 C34.2 C35.2 C36.2 C37.2 C38.2 C39.2 C40.2 C41.2 C42.2 C43.2 C46.2 C47.2 C48.2 C49.2 C52.2 C53.2 C54.2 C55.2 C56.2 C64.2 C65.2 C70.2 C71.2 C72.2 C75.2 C76.2 C77.2 C78.2 C79.2 C80.2 C82.2 C94.2 C96.2 C97.2 C98.2 C99.2 C100.2 D7.1(ANODE) D7.3(ANODE) D11.ANODE H4.1 H4.3 J1.4 J1.8 J1.10 J1.12 J1.16 J1.20 J2.P$21(P21) JP5.1 JP12.1 LED1.C LED6.C LED7.C LED8.C LED9.C LED10.C MP1.P$1 MP2.P$1 R5.1 R11.2 R12.1 R13.1 R14.1 R15.1 R16.1 R20.1 R24.2 R25.1 R30.1 R36.1 R47.1 R51.1 R53.1 R64.1 R65.1 R81.2 S2.P$2 U1.1(GND) U2.3(GND) U3.3(GND) U4.11(P:VSS) U4.21(P:VSS) U4.27(P:VSS) U4.28(P:VSS) U4.34(P:TEST) U4.43(P:VSS) U4.44(P:VSS) U4.47(P:VSS) U4.50(P:VSS) U4.56(P:VSS) U4.67(IO:ADREFLO) U4.68(IO:VSSAD) U4.88(P:VSS) U4.102(P:VSS) U4.103(P:VSS) U4.115(P:VSS) U4.121(P:VSS) U4.122(P:VSS) U4.135(P:VSS) U4.138(P:VSS) U4.144(P:VSS) U5.8(POWER:GND) U6.8(POWER:GND) U7.2(VSS) U7.8(STBY) U8.9(GND2) U8.15(GND2) U10.P$5(GND2) U11.P$5(GND2) U14.1(E2:!E) U14.10(POWER:GND) U14.19(E1:!E) U16.2(GND) U17.3(GND) U18.2(GND) U22.3(GND) U23.3(GND) U24.1(S) U24.2(S) U24.3(S) U25.1(S) U25.2(S) U25.3(S) U27.1(S) U27.2(S) U27.3(S) U30.P$5(GND2) U31.P$5(GND2) U32.1(GND) U33.P$5(GND2) U34.P$5(GND2) U35.1(GND) U38.7(GND) U38.18(GND) U38.21(GND) U38.25(GND) U38.26(TEST) U42.7(GND) U42.PAD1(GND) U42.PAD(GND)
GND1: C17.2 C18.2 C19.2 C20.2 C28.2 J7.6 R28.1 U1.4(0V) U10.P$4(GND1) U11.P$4(GND1) U13.2(VSS) U13.8(STBY)
GND2: C81.2 C87.2 C88.2 C91.2 C93.2 J4.3 J4.4 R27.1 R102.2 R108.1 U30.P$4(GND1) U31.P$4(GND1) U32.4(0V) U36.P$2(GND)
GND3: C3.2 C5.2 C89.2 C90.2 C92.2 J6.3 J6.4 R26.1 R107.2 R109.1 U33.P$4(GND1) U34.P$4(GND1) U35.4(0V) U37.P$2(GND)
HV_BMS_CAN_N [diffPairs]: JP3.3 R1.1 U13.6(CANL)
HV_BMS_CAN_P [diffPairs]: JP4.3 R1.2 U13.7(CANH)
HV_BMS_CAN_RX: JP1.3 U13.4(RXD)
HV_BMS_CAN_TX: JP2.3 U13.1(TXD)
IMD_GND: H4.4 J2.P$4(P4)
IMD_PWM_OUT_3V3: U4.30(IO:N2HET1[2]/SPI4SIMO[0]/EPWM3A) U5.6(C:OUT)
INDICATOR_1: U4.125(IO:N2HET1[14]/USB1.TXSE0) U14.8(G:IN)
INDICATOR_2: U4.124(IO:N2HET1[12]/MII_CRS/RMII_CRS_DV) U14.7(F:IN)
JTAG_RESET: J1.15 U4.46(P:NPORRST)
M_LS: H4.6 R72.2 U5.7(C:IN)
MCU_RESET1: C52.1 R31.1 R32.2 U4.116(P:NRST)
N$2: D3.ANODE U6.10(D:OUT)
N$3: R41.1 U14.14(E:OUT)
N$7: LED6.A R41.2
N$8: R42.1 U14.15(D:OUT)
N$9: R45.1 U14.13(F:OUT)
N$10: Q3.D R18.2 U6.9(D:IN)
N$11: D11.CATHODE R57.2 U5.3(A:IN)
N$12: Q4.D R19.2 U6.7(C:IN)
N$13: R46.2 U14.17(B:OUT)
N$14: D5.ANODE U6.15(F:OUT)
N$15: C82.1 R48.1
N$16: LED7.A R42.2
N$17: R43.1 U14.16(C:OUT)
N$18: R3.2 U14.11(H:OUT)
N$19: LED11.C R46.1
N$21: LED12.C R3.1
N$22: R8.1 U38.22(CBUS1)
N$23: R6.1 U14.18(A:OUT)
N$24: LED1.A R6.2
N$25: LED5.C R7.2
N$26: LED13.C R8.2
N$27: C4.1 U38.17(3V3OUT)
N$28: C9.1 U8.3(VDD1) U8.4(PDEN) U8.5(SPU)
N$30: F1.P$2 J2.P$16(P16)
N$31: JP1.2 U10.P$3(INB)
N$32: JP1.1 JP3.1
N$33: JP2.1 JP4.1
N$35: Q5.D R4.2 U6.5(B:IN)
N$36: D6.ANODE U6.4(B:OUT)
N$37: Q6.D R23.2 U6.3(A:IN)
N$38: D8.ANODE U6.2(A:OUT)
N$39: LED8.A R43.2
N$40: LED9.A R44.2
N$41: LED10.A R45.2
N$42: LED14.C R26.2
N$43: LED15.C R27.2
N$44: LED16.C R28.2
N$45: R29.2 R98.1
N$46: LED3.C R30.2
N$47: U2.4(A:OUT) U3.2(A:IN2) U17.2(A:IN2)
N$48: R33.2 R103.1
N$49: D2.ANODE U6.12(E:OUT)
N$50: LED4.A R35.2
N$51: D4.ANODE U6.6(C:OUT)
N$53: R44.1 U14.12(G:OUT)
N$56: LED2.C R36.2
N$57: L5.1 U16.5(SW)
N$58: R7.1 U38.23(CBUS0)
N$59: L6.1 U18.5(SW)
N$61: C50.1 U4.18(P:OSCIN) Y2.P$1
N$62: C51.1 U4.20(P:OSCOUT) Y2.P$2
N$63: R31.2 S2.P$1
N$64: C50.2 C51.2 U4.19(P:KELVIN_GND)
N$65: LED4.C U4.117(P:NERROR)
N$72_N [USB]: R9.2 U8.6(UD-)
N$72_P [USB]: R10.2 U8.7(UD+)
N$83: D13.CATHODE JP12.2 R57.1
N$84: Q2.D R17.2 U6.11(E:IN)
N$88: R98.2 R99.1
N$89: R99.2 R100.1
N$90: R100.2 R101.1
N$91: U31.P$2(OUTA) U36.P$4(SCLK)
N$92: U30.P$3(INB) U36.P$5(SDATA)
N$93: U30.P$2(OUTA) U36.P$6(!CS)
N$94: U34.P$2(OUTA) U37.P$4(SCLK)
N$96: D1.ANODE Q1.G R5.2
N$97: F1.P$1 Q1.D
N$100: D18.2(ANODE) Q7.G R108.2
N$101: F2.P$2 Q7.D
N$102: F2.P$1 J4.1 J4.2
N$104: U33.P$3(INB) U37.P$5(SDATA)
N$105: U33.P$2(OUTA) U37.P$6(!CS)
N$107: R103.2 R104.1
N$108: R104.2 R105.1
N$109: R105.2 R106.1
N$110: D19.2(ANODE) Q8.G R109.2
N$111: F3.P$2 J6.2 Q8.D
N$112: F3.P$1 J6.1
N$114: D19.1(CATHODE) Q8.S R33.1
N$117: D18.1(CATHODE) Q7.S R29.1
NEG_CONTACTOR_SENSE: H7.4 R63.2 R65.2
NEG_CONTACTOR_SENSE_FILTERED: C65.1 R63.1 U3.1(A:IN1) U4.5(IO:GIOA[1]/USB2.VM/USB_FUNC.RXDMI) U17.1(A:IN1)
NEG_FET: H7.2 U25.5(D) U25.6(D) U25.7(D) U25.8(D) U25.PAD1(D) U25.PAD(D) U25.VIA1(D) U25.VIA2(D) U25.VIA3(D) U25.VIA4(D) U25.VIA5(D) U25.VIA6(D) U25.VIA7(D) U25.VIA8(D) U25.VIA9(D)
NEG_GATE: U22.5(B:OUT) U25.4(G)
NEGATIVE_CONTACTOR_CTRL: U4.140(IO:N2HET1[18]/EPWM6A) U14.5(D:IN) U22.4(B:IN)
NTRST: J1.2 U4.109(P:NTRST)
POS_CONTACTOR_SENSE: H6.4 R62.2 R64.2
POS_CONTACTOR_SENSE_FILTERED: C64.1 R62.1 U2.1(A:IN1) U4.9(IO:GIOA[2]/USB2.TXDAT/USB_FUNC.TXDO/N2HET2[0]/EQEP2I)
POS_FET: H6.2 U24.5(D) U24.6(D) U24.7(D) U24.8(D) U24.PAD1(D) U24.PAD(D) U24.VIA1(D) U24.VIA2(D) U24.VIA3(D) U24.VIA4(D) U24.VIA5(D) U24.VIA6(D) U24.VIA7(D) U24.VIA8(D) U24.VIA9(D)
POS_GATE: U22.7(A:OUT) U24.4(G)
POSITIVE_CONTACTOR_CTRL: U4.141(IO:N2HET1[20]/EPWM6B) U14.6(E:IN) U22.2(A:IN)
PRE_FET: D17.2(ANODE) H1.2 U27.5(D) U27.6(D) U27.7(D) U27.8(D) U27.PAD1(D) U27.PAD(D) U27.VIA1(D) U27.VIA2(D) U27.VIA3(D) U27.VIA4(D) U27.VIA5(D) U27.VIA6(D) U27.VIA7(D) U27.VIA8(D) U27.VIA9(D)
PRECH_GATE: U23.7(A:OUT) U27.4(G)
PRECHARGE_CONTACTOR_CTRL: U2.2(A:IN2) U4.139(IO:N2HET1[16]/EPWM1SYNCI/EPWM1SYNCO) U14.4(C:IN) U23.2(A:IN)
RT_5V2: R47.2 U42.4(RT/CLK)
RTCK: J1.9 U4.113(P:RTCK)
SC_FROM_OUTSIDE_SENSE: U4.36(IO:N2HET1[4]/EPWM4B) U4.37(IO:MIBSPI3NCS[1]/N2HET1[25]/MDCLK) U5.2(A:OUT)
SHUTDOWN_CIRCUIT_FROM_OUTSIDE: D13.ANODE D17.1(CATHODE) H1.1 H6.1 H7.1 J2.P$23(P23)
SW_5V2: C95.2 D7.2(CATHODE) L1.P$1 U42.8(SW)
TCK: J1.11 U4.112(P:TCK)
TDI: J1.3 U4.110(P:TDI)
TDO: J1.7 U4.111(P:TDO)
TMS: J1.1 U4.108(P:TMS)
UART_RX: U4.131(IO:LINRX) U38.1(TXD)
UART_TX: U4.132(IO:LINTX) U38.5(RXD)
USB_D_N [USB]: U8.11(DD-) U38.16(USBDM)
USB_D_P [USB]: U8.10(DD+) U38.15(USBDP)
USBISO_D_N [USB]: J3.2(D-) R9.1
USBISO_D_P [USB]: J3.3(D+) R10.1
USBISO_GND: C8.2 C9.2 J3.4(GND) U8.2(GND1) U8.8(GND1)
USBISO_VCC: C8.1 J3.1(VCC) U8.1(VBUS1)
VCCAD: C31.1 C32.1 L4.2 U4.66(IO:ADREFHI)
VEHICLE_VOLTAGE_FB: R97.1 R106.2 R107.1
VEHICLE_VOLTAGE_IS_AVAILABLE: U4.93(IO:MIBSPI1SIMO[0]) U31.P$6(OUTB)
VEHICLE_VOLTAGE_MONITOR_CS: U4.105(IO:MIBSPI1NCS[0]/MIBSPI1SOMI[1]/MII_TXD[2]/USB1.RCV/ECAP6) U30.P$7(INA)
VOLTAGE_MONITOR_MISO: U4.94(IO:MIBSPI1SOMI[0]) U30.P$6(OUTB) U33.P$6(OUTB)
VOLTAGE_MONITOR_SCLK: U4.95(IO:MIBSPI1CLK) U31.P$7(INA) U34.P$7(INA)
WAKEUP: U4.1(IO:GIOB[3]/USB2.RCV/USB_FUNC.RXDI) U10.P$7(INA)
WAKEUP_HV: J7.1 U10.P$2(OUTA)
Unconnected: H1.3 H1.4 H4.5 H4.7 J1.6 J1.13 J1.14 J1.17 J1.18 J1.19 J2.P$10(P10) J2.P$11(P11) J2.P$12(P12) J2.P$13(P13) J2.P$14(P14) J2.P$15(P15) J2.P$17(P17) J2.P$18(P18) J2.P$19(P19) J2.P$20(P20) J2.P$22(P22) U4.3(IO:MIBSPI3NCS[3]/I2C_SCL/N2HET1[29]/NTZ1) U4.4(IO:MIBSPI3NCS[2]/I2C_SDA/N2HET1[27]/NTZ2) U4.6(IO:N2HET1[11]/MIBSPI3NCS[4]/N2HET2[18]/USB2.OVERCURRENT/USB_FUNC.VBUSI/EPWM1SYNCO) U4.7(P:FLTP1) U4.8(P:FLTP2) U4.12(IO:CAN3RX) U4.13(IO:CAN3TX) U4.15(IO:N2HET1[22]/USB2.TXSE0/USB_FUNC.SE0O) U4.23(IO:N2HET1[1]/SPI4NENA/USB2.TXEN/USB_FUNC.PUENO/N2HET2[8]/EQEP2A) U4.24(IO:N2HET1[3]/SPI4NCS[0]/USB2.SPEED/USB_FUNC.PUENON/N2HET2[10]/EQEP2B) U4.25(IO:N2HET1[0]/SPI4CLK/EPWM2B) U4.31(IO:N2HET1[5]/SPI4SOMI[0]/N2HET2[12]/EPWM3B) U4.32(IO:MIBSPI5NCS[0]/EPWM4A) U4.33(IO:N2HET1[7]/USB2.PORTPOWER/USB_FUNC.GZO/N2HET2[14]/EPWM7B) U4.35(IO:N2HET1[9]/N2HET2[16]/USB2.SUSPEND/USB_FUNC.SUSPENDO/EPWM7A) U4.41(IO:N2HET1[15]/MIBSPI1NCS[4]/ECAP1) U4.51(IO:MIBSPI3SOMI[0]/AWM1_EXT_ENA/ECAP2) U4.52(IO:MIBSPI3SIMO[0]/AWM1_EXT_SEL[0]/ECAP3) U4.53(IO:MIBSPI3CLK/AWM1_EXT_SEL[1]/EQEP1A) U4.54(IO:MIBSPI3NENA/MIBSPI3NCS[5]/N2HET1[31]/EQEP1B) U4.55(IO:MIBSPI3NCS[0]/AD2EVT/GIOB[2]/EQEP1I/N2HET2_PIN_NDIS) U4.58(IO:AD1IN[16]/AD2IN[0]) U4.59(IO:AD1IN[17]/AD2IN[1]) U4.60(IO:AD1IN[0]) U4.61(IO:AD1IN[7]) U4.62(IO:AD1IN[18]/AD2IN[2]) U4.63(IO:AD1IN[19]/AD2IN[3]) U4.64(IO:AD1IN[20]/AD2IN[4]) U4.65(IO:AD1IN[21]/AD2IN[5]) U4.70(IO:AD1IN[9]/AD2IN[9]) U4.71(IO:AD1IN[1]) U4.72(IO:AD1IN[10]/AD2IN[10]) U4.75(IO:AD1IN[11]/AD2IN[11]) U4.76(IO:AD1IN[4]) U4.77(IO:AD1IN[12]/AD2IN[12]) U4.78(IO:AD1IN[5]) U4.79(IO:AD1IN[13]/AD2IN[13]) U4.80(IO:AD1IN[6]) U4.81(IO:AD1IN[22]/AD2IN[6]) U4.82(IO:AD1IN[14]/AD2IN[14]) U4.83(IO:AD1IN[8]/AD2IN[8]) U4.84(IO:AD1IN[23]/AD2IN[7]) U4.85(IO:AD1IN[15]/AD2IN[15]) U4.86(IO:AD1EVT/MII_RX_ER/RMII_RX_ER) U4.91(IO:N2HET1[24]/MIBSPI1NCS[5]/MII_RXD[0]/RMII_RXD[0]) U4.92(IO:N2HET1[26]/MII_RXD[1]/RMII_RXD[1]) U4.96(IO:MIBSPI1NENA/N2HET1[23]/MII_RXD[2]/USB1.VP/ECAP4) U4.97(IO:MIBSPI5NENA/MII_RXD[3]/USB1.VM/MIBSPI5SOMI[1]/ECAP5) U4.98(IO:MIBSPI5SOMI[0]/MII_TXD[0]/RMII_TXD[0]) U4.99(IO:MIBSPI5SIMO[0]/MII_TXD[1]/RMII_TXD[1]/MIBSPI5SOMI[2]) U4.100(IO:MIBSPI5CLK/MII_TXEN/RMII_TXEN) U4.106(IO:N2HET1[8]/MIBSPI1SIMO[1]/MII_TXD[3]/USB1.OVERCURRENT) U4.107(IO:N2HET1[28]/MII_RXCLK/RMII_REFCLK/MII_RX_VCLKA4) U4.118(IO:N2HET1[10]/MII_TXCLK/USB1.TXEN/MII_TX_VCLKA4/NTZ3) U4.119(P:ECLK) U4.127(IO:N2HET1[30]/MII_RX_DV/USB1.SPEED/EQEP2S) U5.9(D:IN) U5.10(D:OUT) U5.11(E:IN) U5.12(E:OUT) U5.14(F:IN) U5.15(F:OUT) U23.4(B:IN) U23.5(B:OUT) U38.2(!DTR) U38.3(!RTS) U38.6(!RI) U38.9(!DSR) U38.10(!DCD) U38.11(!CTS) U38.12(CBUS4) U38.13(CBUS2) U38.14(CBUS3) U38.27(OSCI) U38.28(OSCO)

## Notes on the sheet
- PLACE in HV section
- ISOLATED COMPONENTS
- Current Sensor
- GLVS Connector | JTAG
- Connector to interface with the wiring
  harness in the Grounded Low Voltage
  System
- BMS Module Connector
- Reverse voltage
  protection
- KEY
- If we want to buffer the input from the current sensor board we could use these?
- Needs a 10k pulldown at receiver end
- Needs a 10k pulldown at receiver end
- Needs a 10k pulldown at receiver end
- Needs a 10k pulldown at receiver end
- SOURCE 400v Connectors
- 5V Regulator | MICROCONTROLLER
- VEHICLE VOLTAGE CONNECTIONS
- Connect to TS voltage outside the contactors
- 7443251000
- CONNECTION TO
  TS BATTERY POSITIVE
  TERMINAL
- @400V outputs 5.263V
- CONNECTION TO
  TS BATTERY NEGATIVE
  TERMINAL
- Reverse voltage
  protection
- ISOLATED DC-DC CONVERTER
- 3V3 Regulator | 1V2 Regulator
- +3v3 buck | +1v2 buck
- SOURCE 400v Connectors
- 74479775222 | 74479775222
- BATTERY VOLTAGE CONNECTIONS
- Connect to TS voltage inside the contactors
- CAN TRANSCEIVER | IMD CONNECTOR
- Connects to the low volt side of the IMD
- CONNECTION TO
  TS BATTERY POSITIVE
  TERMINAL
- CAR CAN
- Connection after the fuse to offer
  protection to the IMD
- @400V outputs 5.263V
- Reverse voltage
  protection
- CONNECTION TO
  TS BATTERY NEGATIVE
  TERMINAL
- Indicator LEDs
- Indicator LEDs show the status of the system
  
  IMD_FAULT and FAULT_AMS_INDCATOR are
  is an active low error (the signal
  is low when there is a fault) so it requires an
  extra MOSFET to invert the signal for the LEDs
- ISOLATED DC-DC CONVERTER
- OUTPUT BUFFERS | CONTACTOR RELAYS
- CONTACTOR STATE DETECTION
- Level shift the logic up to GLV 
  battery level.
  
  Buffer separates the GIO pin of
  the microcontroller from the GLV
  connector
- low-side mosfet controller, don't really have a good use for it, 
  unless we want to power the fans?
- The main contactors have a secondary
  coil which we use to detect if the contacts have welded shut. When the contact is closed,
  the sense pin will be shorted to 3v3. When the contact is open, the sense pin is pulled to
  GND by a 10k resistor.
  
  Logic 0 on CONTACTOR_OPEN indicates that at least one contactor is open. Logic 1indicates
  that no contactors are open.
  
  A 0 on CONTACTOR_CLOSED indicates that at least one contactor is closed. Logic 1 indicates
  that no contactors are closed.
- SOURCE 400v Connectors
- Low-side MOSFETs to control power to
  the battery contactors
- USB to Serial Converter
- Needs a 10k pulldown
  at receiver end
- (+) MAIN CONTACTOR POSITIVE
- Current Short Indicator??
- Look at 100V rated MOSFETS?
  https://www.gigavac.com/sites/default/files/catalog/spec_sheet/gx14.pdf
  Looks like it can have 55V Back EMF even with Suppression.
- (-) MAIN CONTACTOR NEGATIVE
- Needs a 10k pulldown
  at receiver end
- TX | PRECHARGE CONTACTOR
- RX
- Needs a 10k pulldown
  at receiver end
- ISOLATED USB INTERFACE
- Needs a 10k pulldown
  at receiver end
- Active low fault | Active low fault
- SHUTDOWN CIRCUIT

## Library data of the parts
C1 C2 C4 C6-C11 C13 C15-C27 C32-C37 C39 C41-C43 C46-C49 C53 C54 C56 C75-C78 C87-C92 C95 = rcl:C-US: CAPACITOR, American symbol; PARTNO: GRM188R71E104KA01D
C3 C93 = rcl:C-US: CAPACITOR, American symbol
C5 C12 C14 C28 C31 C64 C65 C79-C81 = rcl:C-US: CAPACITOR, American symbol; PARTNO: GRM188R61A475KE15D
C38 C55 C70 C72 C99 C100 = rcl:C-US: CAPACITOR, American symbol; PARTNO: GRM188R61A106KE69D
C40 C71 = rcl:C-US: CAPACITOR, American symbol; PARTNO: GRM188R61E475KE11D
C50 C51 = rcl:C-US: CAPACITOR, American symbol; PARTNO: C1608C0G1H220J080AA
C52 = rcl:C-US: CAPACITOR, American symbol; PARTNO: GRM188R61E105KA12D
C82 = rcl:C-US: CAPACITOR, American symbol; PARTNO: GRM188R71H123KA01D
C94 = rcl:C-US: CAPACITOR, American symbol; PARTNO: GRM1885C1H9R0DA01D
C96 C97 = rcl:C-US: CAPACITOR, American symbol; PARTNO: GRM31CR71H475KA12L
C98 = rcl:C-US: CAPACITOR, American symbol; PARTNO: GRM31CR61A476ME15L
D1 = FormE:MM3Z12VB; PARTNO: MM3Z12VB
D2-D6 D8 D13 = FormE:BAV21W; PARTNO: BAV21WS-TP
D7 = FormE:VISHAY-50WQ10FNPBF; PARTNO: VS-50WQ10FNPBF
D11 = FormE:MM3Z18VT1G; PARTNO: MM3Z18VT1G
D17 = FormE:ES1D; PARTNO: ES1D
D18 D19 = FormE:CMZ59; PARTNO: CMZ5928B TR13
F1 = FormE:FUSE_GENERIC_1206; PARTNO: 0458005.DR
F2 F3 = FormE:LITTELFUSE_485; PARTNO: 0485001.DR
H1 H6 H7 = FormE:MOLEX_502443-0470; PARTNO: 5024430470
H2 = FormE:MOUNT-HOLE-NPTH
H4 = FormE:MOLEX_502443-0870; PARTNO: 5024430870
H16 = FormE:GENERIC_BLOCK; PARTNO: MUSB2D11004BP
J1 = FormE:CTI-20-MALE; PARTNO: M50-3601042
J2 = FormE:TE-776087: Ampseal 23-pin right-angle; PARTNO: 776087-1
J3 = FormE:MUSBD111XX; PARTNO: MUSBD11130; VALUE: MUSBD111130
J4 J6 = FormE:MOLEX_43650-0416: Micro-Fit 3.0 Connector; 3DS_PART_NUMBER: 610-00126; CENTROID_NOT_SPECIFIED: No; CONN_GENDER: Male; CONN_ORIENTATION: Vertical; CONTACT_MATERIAL: Gold,Nickel; CURRENT_RATING: 8.5A; DATASHEET: https://www.molex.com/pdm_docs/sd/436500416_sd.pdf; DEVICE_CLASS_L1: Connectors; DEVICE_CLASS_L2: Headers and Wire Housings; DEVICE_CLASS_L3: unset; DIGIKEY_DESCRIPTION: CONN HEADER 4POS 3MM VERT GOLD; DIGIKEY_PART_NUMBER: WM1924-ND; FOOTPRINT_VARIANT_NAME_0: Recommended_Land_Pattern; HEIGHT: 17.81mm; IS_FEMALE: yes; LEAD_FREE: yes; MF: Molex; MFG_PACKAGE_IDENT: 43650-0416; MFG_PACKAGE_IDENT_COMPONENT_ID: d37de214a51170b4; MFG_PACKAGE_IDENT_DATE: 0; MFG_PACKAGE_IDENT_REV: 0; MOUSER_DESCRIPTION: Headers & Wire Housings MICRO-FIT 3.0 HEADER; MOUSER_PART_NUMBER: 538-43650-0416; MPN: 43650-0416; NUMBER_OF_CONTACTS: 4; NUMBER_OF_ROWS: 1; PACKAGE: HDR4; PREFIX: J; ROHS: yes; STANDOFF_HEIGHT: 0mm; TEMPERATURE_RANGE_HIGH: +105°C; TEMPERATURE_RANGE_LOW: -40°C; VERIFICATION_VERSION: 0.0.0.3; VOLTAGE_RATING: 600V
J7 = FormE:MOLEX_43650-0616
JP1-JP4 JP6 JP7 JP12 = FormE:TWO-WAY-JUMPER; PARTNO: ERJ-3EKF1002V
JP5 = pinhead:PINHD-1X8: PIN HEADER
L1 = FormE:WURTH-744325XXXX; PARTNO: 7443251000
L4 = launchpad:INDUCTOR; PARTNO: BLM21PG221SN1D
L5 L6 = FormE:L0805; PARTNO: 74479775222
LED1 LED4 LED11 LED12 = FormE:LED: LED OSRAM: - CHIPLED LG R971, LG N971, LY N971, LG Q971, LY Q971, LO R971, LY R971 LH N974, LH R974 LS Q976, LO Q976, LY Q976 LO Q996 - Hyper CHIPLED LW Q18S LB Q993, LB Q99A, LB R99A - SideLED LS A670, LO A670, LY A670, LG A670, LP A670 LB A673, LV A673, LT A673, LW A673 LH A674 LY A675 LS A676, LA A676, LO A676, LY A676, LW A676 LS A679, LY A679, LG A679 - Hyper Micro SIDELED® LS Y876, LA Y876, LO Y876, LY Y876 LT Y87S - SmartLED LW L88C, LW L88S LB L89C, LB L89S, LG L890 LS L89K, LO L89K, LY L89K LS L896, LA L896, LO L896, LY L896 - TOPLED LS T670, LO T670, LY T670, LG T670, LP T670 LSG T670, LSP T670, LSY T670, LOP T670, LYG T670 LG T671, LOG T671, LSG T671 LB T673, LV T673, LT T673, LW T673 LH T674 LS T676, LA T676, LO T676, LY T676, LB T676, LH T676, LSB T676, LW T676 LB T67C, LV T67C, LT T67C, LS T67K, LO T67K, LY T67K, LW E67C LS E67B, LA E67B, LO E67B, LY E67B, LB E67C, LV E67C, LT E67C LW T67C LS T679, LY T679, LG T679 LS T770, LO T770, LY T770, LG T770, LP T770 LB T773, LV T773, LT T773, LW T773 LH T774 LS E675, LA E675, LY E675, LS T675 LS T776, LA T776, LO T776, LY T776, LB T776 LHGB T686 LT T68C, LB T68C - Hyper Mini TOPLED® LB M676 - Mini TOPLED Santana® LG M470 LS M47K, LO M47K, LY M47K Source: http://www.osram.convergy.de/; PARTNO: 5988110107F
LED2 LED3 LED6-LED9 LED14-LED16 = FormE:LED: LED OSRAM: - CHIPLED LG R971, LG N971, LY N971, LG Q971, LY Q971, LO R971, LY R971 LH N974, LH R974 LS Q976, LO Q976, LY Q976 LO Q996 - Hyper CHIPLED LW Q18S LB Q993, LB Q99A, LB R99A - SideLED LS A670, LO A670, LY A670, LG A670, LP A670 LB A673, LV A673, LT A673, LW A673 LH A674 LY A675 LS A676, LA A676, LO A676, LY A676, LW A676 LS A679, LY A679, LG A679 - Hyper Micro SIDELED® LS Y876, LA Y876, LO Y876, LY Y876 LT Y87S - SmartLED LW L88C, LW L88S LB L89C, LB L89S, LG L890 LS L89K, LO L89K, LY L89K LS L896, LA L896, LO L896, LY L896 - TOPLED LS T670, LO T670, LY T670, LG T670, LP T670 LSG T670, LSP T670, LSY T670, LOP T670, LYG T670 LG T671, LOG T671, LSG T671 LB T673, LV T673, LT T673, LW T673 LH T674 LS T676, LA T676, LO T676, LY T676, LB T676, LH T676, LSB T676, LW T676 LB T67C, LV T67C, LT T67C, LS T67K, LO T67K, LY T67K, LW E67C LS E67B, LA E67B, LO E67B, LY E67B, LB E67C, LV E67C, LT E67C LW T67C LS T679, LY T679, LG T679 LS T770, LO T770, LY T770, LG T770, LP T770 LB T773, LV T773, LT T773, LW T773 LH T774 LS E675, LA E675, LY E675, LS T675 LS T776, LA T776, LO T776, LY T776, LB T776 LHGB T686 LT T68C, LB T68C - Hyper Mini TOPLED® LB M676 - Mini TOPLED Santana® LG M470 LS M47K, LO M47K, LY M47K Source: http://www.osram.convergy.de/; PARTNO: 598-8170-107F
LED5 LED10 LED13 = FormE:LED: LED OSRAM: - CHIPLED LG R971, LG N971, LY N971, LG Q971, LY Q971, LO R971, LY R971 LH N974, LH R974 LS Q976, LO Q976, LY Q976 LO Q996 - Hyper CHIPLED LW Q18S LB Q993, LB Q99A, LB R99A - SideLED LS A670, LO A670, LY A670, LG A670, LP A670 LB A673, LV A673, LT A673, LW A673 LH A674 LY A675 LS A676, LA A676, LO A676, LY A676, LW A676 LS A679, LY A679, LG A679 - Hyper Micro SIDELED® LS Y876, LA Y876, LO Y876, LY Y876 LT Y87S - SmartLED LW L88C, LW L88S LB L89C, LB L89S, LG L890 LS L89K, LO L89K, LY L89K LS L896, LA L896, LO L896, LY L896 - TOPLED LS T670, LO T670, LY T670, LG T670, LP T670 LSG T670, LSP T670, LSY T670, LOP T670, LYG T670 LG T671, LOG T671, LSG T671 LB T673, LV T673, LT T673, LW T673 LH T674 LS T676, LA T676, LO T676, LY T676, LB T676, LH T676, LSB T676, LW T676 LB T67C, LV T67C, LT T67C, LS T67K, LO T67K, LY T67K, LW E67C LS E67B, LA E67B, LO E67B, LY E67B, LB E67C, LV E67C, LT E67C LW T67C LS T679, LY T679, LG T679 LS T770, LO T770, LY T770, LG T770, LP T770 LB T773, LV T773, LT T773, LW T773 LH T774 LS E675, LA E675, LY E675, LS T675 LS T776, LA T776, LO T776, LY T776, LB T776 LHGB T686 LT T68C, LB T68C - Hyper Mini TOPLED® LB M676 - Mini TOPLED Santana® LG M470 LS M47K, LO M47K, LY M47K Source: http://www.osram.convergy.de/; PARTNO: 598-8130-107F
MP1 MP2 = FormE:MOUNT-HOLE
Q1 = FormE:STD45P4LLF6AG; PARTNO: STD45P4LLF6AG; VALUE: STD45P4LLF6AG
Q2-Q6 = FormE:BSS138; PARTNO: BSS138
Q7 Q8 = FormE:FQD3P50; PARTNO: FQD3P50TM
R1 R2 = rcl:R-US_: RESISTOR, American symbol; PARTNO: ERJ-3EKF1200V
R3 R6 R26-R28 R30 R36 R41-R46 = rcl:R-US_: RESISTOR, American symbol; PARTNO: ERJ-3EKF1001V
R4 R11 R17-R24 R64 R65 R102 R107 = rcl:R-US_: RESISTOR, American symbol; PARTNO: ERJ-3EKF1002V
R5 R57 = rcl:R-US_: RESISTOR, American symbol; PARTNO: ERJ-3EKF1501V
R7 R8 = rcl:R-US_: RESISTOR, American symbol; PARTNO: ERJ-3EKF2700V
R9 R10 = rcl:R-US_: RESISTOR, American symbol; PARTNO: ERJ-3EKF24R0V
R12-R16 R25 = rcl:R-US_: RESISTOR, American symbol
R29 R33 R98-R101 R103-R106 = rcl:R-US_: RESISTOR, American symbol; PARTNO: ERJ-6ENF1503V
R31 = rcl:R-US_: RESISTOR, American symbol; PARTNO: ERJ-3EKF1000V
R32 R35 R72 R81 = rcl:R-US_: RESISTOR, American symbol; PARTNO: ERJ-3EKF2201V
R47 = rcl:R-US_: RESISTOR, American symbol; PARTNO: ERJ-3EKF1623V
R48 = rcl:R-US_: RESISTOR, American symbol; PARTNO: ERJ-3EKF1502V
R50 = rcl:R-US_: RESISTOR, American symbol; PARTNO: ERJ-3EKF6042V
R51 = rcl:R-US_: RESISTOR, American symbol; PARTNO: ERJ-3EKF1152V
R52 R53 = rcl:R-US_: RESISTOR, American symbol; PARTNO: *
R62 R63 = rcl:R-US_: RESISTOR, American symbol; PARTNO: ERJ-3EKF2002V
R96 R97 = rcl:R-US_: RESISTOR, American symbol; PARTNO: ERJ-3GEY0R00V
R108 R109 = rcl:R-US_: RESISTOR, American symbol; PARTNO: ERJ-6ENF1004V
S2 = FormE:TE-147873-2; PARTNO: 147873-2
U1 U32 U35 = FormE:PDS1-M; PARTNO: PDS1-S5-S5-M-TR
U2 = FormE:LL_OR:SN74LVC1G32-Q1: Little Logic OR Gate; PARTNO: SN74LVC1G32DBVR
U3 = FormE:LL_AND:SN74LVC1G08: Little Logic AND Gate; PARTNO: SN74LVC1G08DBVR
U4 = FormE:RM46L852: RM46 Cortex-R4 MCU
U5 U6 = FormE:CD4050B; PARTNO: CD4050BDR
U7 U13 = FormE:MCP256X: MCP2561/2 CAN Transceiver Microchip High-Speed CAN Transceiver Datasheet <http://ww1.microchip.com/downloads/en/DeviceDoc/20005167C.pdf>; PARTNO: MCP2562FD-E/SN
U8 = FormE:ADUM3160; PARTNO: ADUM3160BRWZ-RL
U10 U11 U30 U31 U33 U34 = FormE:ISO7221; PARTNO: ISO7221CDR
U14 = FormE:SN74LVC541A; PARTNO: SN74LVC541APWR
U16 = FormE:LM3671; PARTNO: LM3671MF-3.3/NOPB
U17 = FormE:LL_NOR:SN74LVC1G02: Little Logic NOR Gate; PARTNO: SN74LVC1G02DBVR
U18 = FormE:LM3671; PARTNO: LM3671MF-1.2/NOPB
U22 U23 = FormE:FAN3214; PARTNO: FAN3214TMX
U24 U25 U27 = FormE:CSD17506Q5A; PARTNO: CSD17506Q5A
U36 U37 = FormE:ADC121S021; PARTNO: ADC121S021CIMF/NOPB
U38 = ftdichip:FT232R: Source: http://www.ftdichip.com/Documents/DataSheets/DS_FT232R_v104.pdf; MPN: FT232RL; OC_FARNELL: 1146032; OC_NEWARK: 91K9918; PARTNO: FT232RL-REEL
U42 = FormE:TPS54540; PARTNO: TPS54540DDAR
Y2 = FormE:CSM-3X; PARTNO: ECS-160-20-3X-TR

## Net classes
0 default: width 0.203 mm, drill 0.5 mm, clearance 0.203 mm
1 diffPairs: width 0.254 mm, drill 0.5 mm, clearance 0.254 mm
3 USB: width 0.254 mm, drill 0.5 mm, clearance 0.254 mm